# Altium project MB784.PrjPCB
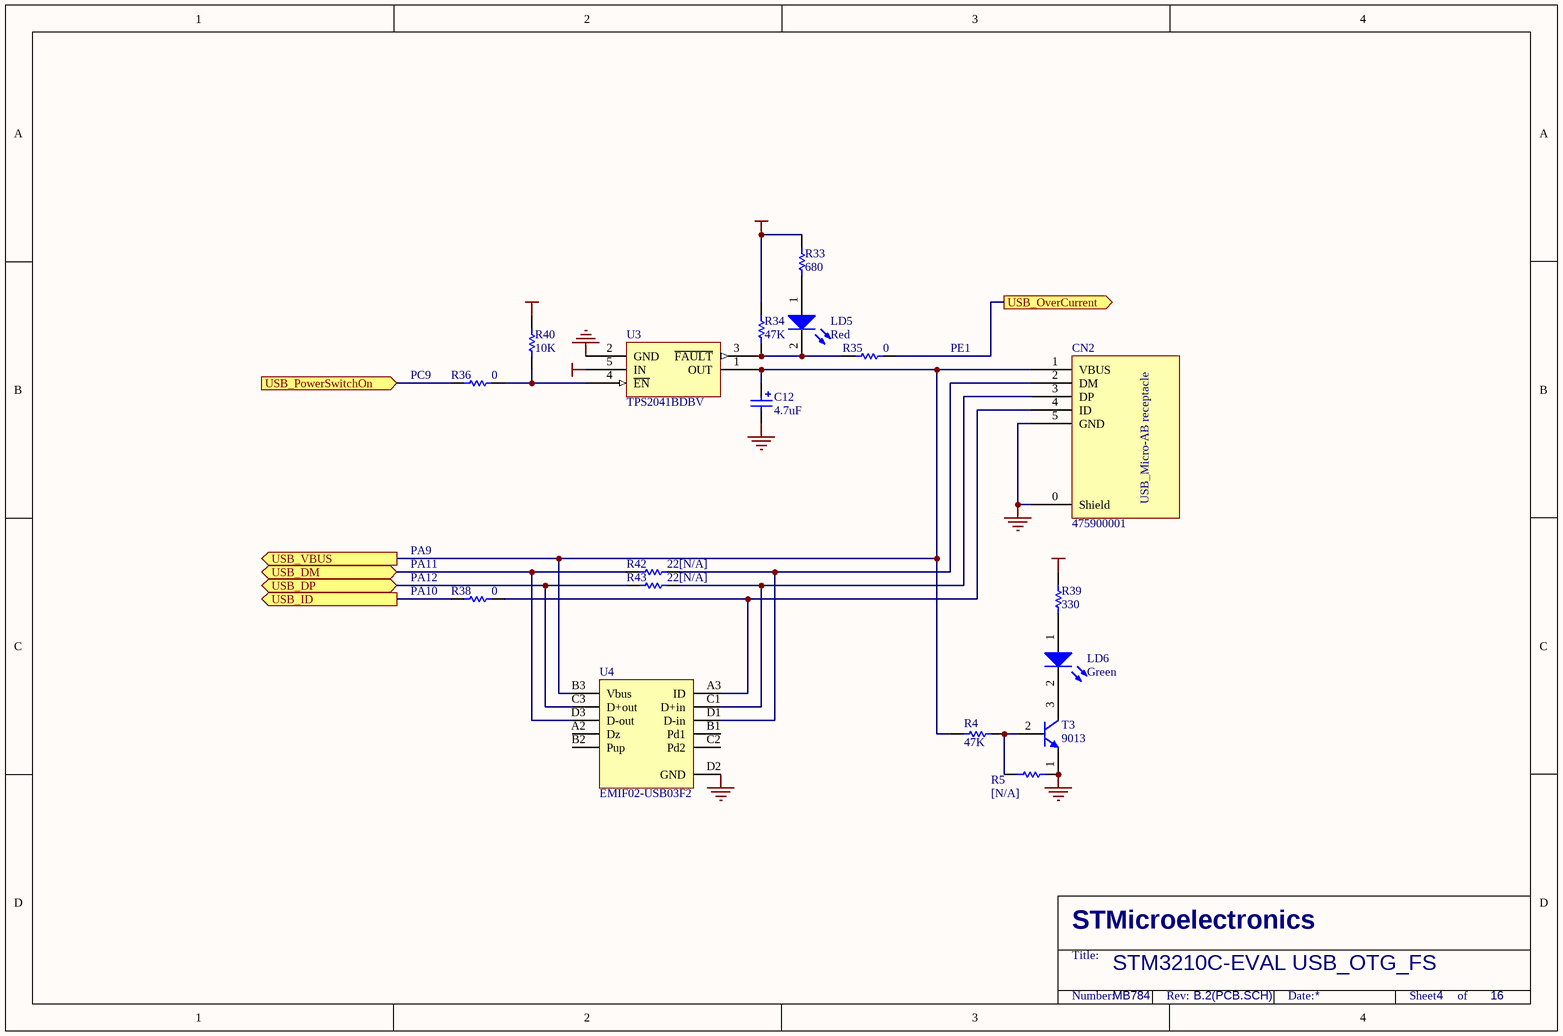
[diagram p0: USB_OTG_FS.SchDoc]
10 sheets, 267 parts. Net scope: flat (ports and power ports of the same name join across sheets).
Board file: MB784.PCBDOC
Sheets:
  USB_OTG_FS.SchDoc
  Ethernet.SchDoc
  IO_Expandor.SchDoc
  MCU.SchDoc
  Audio.SchDoc
  IO Peripherals.SchDoc
  ExtensionConnector.SchDoc
  JTAG&Trace.SchDoc
  Power.SchDoc
  MicroSDCard.SchDoc

## Sheet USB_OTG_FS.SchDoc
size A4; Revision: B.2(PCB.SCH)

### Parts
C12  4.7uF  [TAN-A]
CN2  475900001  [USB-MICRO-AB]
LD5  Red  [0603D]
LD6  Green  [0603D]
R4  47K  [0603R]
R5  [N/A]  [0603R]
R33  680  [0603R]
R34  47K  [0603R]
R35  0  [0603R]
R36  0  [0603R]
R38  0  [0603R]
R39  330  [0603R]
R40  10K  [0603R]
R42  22[N/A]  [0603R]
R43  22[N/A]  [0603R]
T3  9013  [SOT-23]
U3  TPS2041BDBV  [SOT-23-5L]
U4  EMIF02-USB03F2  [FlipChip(11)]

### Ports
USB_DM (bidir), USB_DP (bidir), USB_ID (out), USB_OverCurrent (out), USB_PowerSwitchOn (in), USB_VBUS (out)

### Nets
+3V3: R33.2 R34.1 R39.2 R40.1
+5V: U3.5(IN)
GND: C12.2 CN2.0(Shield) CN2.5(GND) R5.1 T3.1(E) U3.2(GND) U4.D2(GND)
PA10: R38.2 ; port USB_ID
PA11: R42.2 U4.D3(D-out) ; port USB_DM
PA12: R43.2 U4.C3(D+out) ; port USB_DP
PC9: R36.2 ; port USB_PowerSwitchOn
PE1: R35.1 ; port USB_OverCurrent
NetC12_1: C12.1 CN2.1(VBUS) R4.2 U3.1(OUT) U4.B3(Vbus) ; port USB_VBUS
NetCN2_2: CN2.2(DM) R42.1 U4.D1(D-in)
NetCN2_3: CN2.3(DP) R43.1 U4.C1(D+in)
NetCN2_4: CN2.4(ID) R38.1 U4.A3(ID)
NetLD5_1: LD5.1(A) R33.1
NetLD5_2: LD5.2(K) R34.2 R35.2 U3.3(~{FAULT})
NetLD6_1: LD6.1(A) R39.1
NetLD6_2: LD6.2(K) T3.3(C)
NetR4_1: R4.1 R5.2 T3.2(B)
NetR36_1: R36.1 R40.2 U3.4(~{EN})

Not connected (* = marked no-connect by the designer): U4 A2(Dz) B1(Pd1) B2(Pup) C2(Pd2)

### Notes on the sheet
- (near R36) PC9
- PE1
- PA9
- (near R38) PA11
- (near R38) PA12
- (near R38) PA10
- STM3210C-EVAL USB_OTG_FS
- MB784
- 4
- 16
- STMicroelectronics
- Title:
- Number:
- Rev:
- Date:
- Sheet       of
- (in symbol 475900001) USB_Micro-AB receptacle

### Library data of the parts
C12 = Cap Pol1: Polarized Capacitor (Radial); Value: 47uF; Published: 8-Jun-2000; Revision: July-2002: Re-released for DXP Platform.; Publisher: Altium Limited
LD5 LD6 = LED2: Typical RED, GREEN, YELLOW, AMBER GaAs LED; Published: 8-Jun-2000; Revision: July-2002: Re-released for DXP Platform.; Publisher: Altium Limited
R4 R5 R34 R39 R40 = res1: Resistor; Value: 1K; Published: 8-Jun-2000; Revision: July-2002: Re-released for DXP Platform.; Publisher: Altium Limited
R33 R35 R36 R38 R42 R43 = Res1: Resistor; Value: 1K; Published: 8-Jun-2000; Revision: July-2002: Re-released for DXP Platform.; Publisher: Altium Limited
T3 = NPN: NPN Bipolar Transistor; Code - JEDEC: TO-226-AA; Published: 8-Jun-2000; Revision: July-2002: Re-released for DXP Platform.; Publisher: Altium Limited
U3 = STMPS2141STR

## Sheet Ethernet.SchDoc
size A4; Revision: B.2(PCB.SCH)
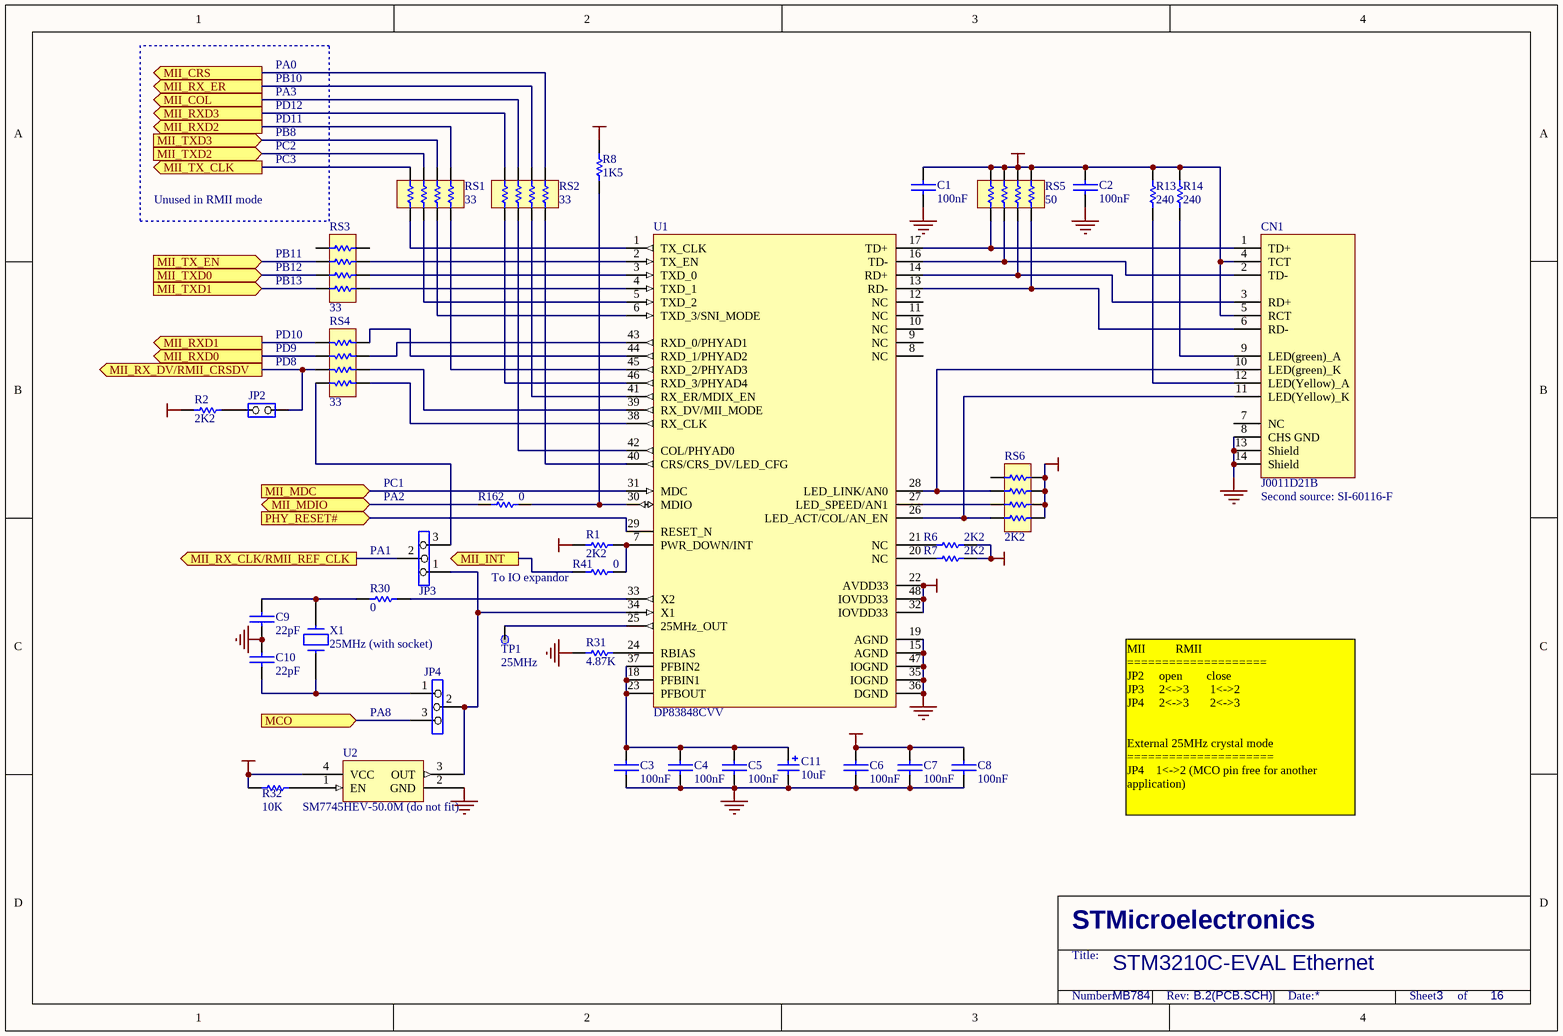
[diagram p1: Ethernet.SchDoc]

### Parts
C1  100nF  [0603C]
C2  100nF  [0603C]
C3  100nF  [0603C]
C4  100nF  [0603C]
C5  100nF  [0603C]
C6  100nF  [0603C]
C7  100nF  [0603C]
C8  100nF  [0603C]
C9  22pF  [0603R]
C10  22pF  [0603R]
C11  10uF  [TAN-A]
CN1  J0011D21B  [J0011D21B]
JP2  (no value)  [SIP2]
JP3  (no value)  [SIP3]
JP4  (no value)  [SIP3]
R1  2K2  [0603R]
R2  2K2  [0603R]
R6  2K2  [0603R]
R7  2K2  [0603R]
R8  1K5  [0603R]
R13  240  [0603R]
R14  240  [0603R]
R30  0  [0603R]
R31  4.87K  [0603R]
R32  10K  [0603R]
R41  0  [0603R]
R162  0  [0603R]
RS1  33  [RES-4B]
RS2  33  [RES-4B]
RS3  33  [RES-4B]
RS4  33  [RES-4B]
RS5  50  [RES-4B]
RS6  2K2  [RES-4B]
TP1  25MHz  [TP]
U1  DP83848CVV  [LQFP48]
U2  SM7745HEV-50.0M (do not fit)  [XTAL_5X7]
X1  25MHz (with socket)  [XTAL1]

### Ports
MCO (in), MII_COL (out), MII_CRS (out), MII_INT (out), MII_MDC (in), MII_MDIO (bidir), MII_RX_CLK/RMII_REF_CLK (out), MII_RX_DV/RMII_CRSDV (out), MII_RX_ER (out), MII_RXD0 (out), MII_RXD1 (out), MII_RXD2 (out), MII_RXD3 (out), MII_TX_CLK (out), MII_TX_EN (in), MII_TXD0 (in), MII_TXD1 (in), MII_TXD2 (in), MII_TXD3 (in), PHY_RESET# (in)

### Nets
+3V3: C1.2 C2.2 C6.1 C7.2 C8.2 CN1.4(TCT) CN1.5(RCT) R1.1 R2.2 R6.2 R7.2 R8.2 R13.2 R14.2 R32.1 RS5.1 RS5.3 RS5.5 RS5.7 RS6.1 RS6.3 RS6.5 RS6.7 U1.22(AVDD33) U1.32(IOVDD33) U1.48(IOVDD33) U2.4(VCC)
GND: C1.1 C2.1 C3.2 C4.1 C5.1 C6.2 C7.1 C8.1 C9.1 C10.2 C11.2 CN1.8(CHS_GND) CN1.13(Shield) CN1.14(Shield) R31.1 U1.15(AGND) U1.19(AGND) U1.35(IOGND) U1.36(DGND) U1.47(IOGND) U2.2(GND)
PA1: JP3.2 ; port MII_RX_CLK/RMII_REF_CLK
PA2: R162.1 ; port MII_MDIO
PA3: RS2.4 ; port MII_COL
PA8: JP4.3 ; port MCO
PB8: RS1.6 ; port MII_TXD3
PB10: RS2.6 ; port MII_RX_ER
PB11: RS3.6 ; port MII_TX_EN
PB12: RS3.4 ; port MII_TXD0
PB13: RS3.2 ; port MII_TXD1
PC1: U1.31(MDC) ; port MII_MDC
PC2: RS1.4 ; port MII_TXD2
PC3: RS1.2 ; port MII_TX_CLK
PD11: RS1.8 ; port MII_RXD2
PD12: RS2.2 ; port MII_RXD3
NetC3_1: C3.1 C4.2 C5.2 C11.1 U1.18(PFBIN1) U1.23(PFBOUT) U1.37(PFBIN2)
NetC9_2: C9.2 R30.2 X1.2
NetC10_1: C10.1 JP4.1 X1.1
NetCN1_1: CN1.1(TD+) RS5.8 U1.17(TD+)
NetCN1_2: CN1.2(TD-) RS5.6 U1.16(TD-)
NetCN1_3: CN1.3(RD+) RS5.4 U1.14(RD+)
NetCN1_6: CN1.6(RD-) RS5.2 U1.13(RD-)
NetCN1_9: CN1.9(LED(green)_A) R14.1
NetCN1_10: CN1.10(LED(green)_K) RS6.6 U1.28(LED_LINK/AN0)
NetCN1_11: CN1.11(LED(Yellow)_K) RS6.2 U1.26(LED_ACT/COL/AN_EN)
NetCN1_12: CN1.12(LED(Yellow)_A) R13.1
NetJP2_1: JP2.1(COMMON) RS4.6 ; port MII_RX_DV/RMII_CRSDV
NetJP2_2: JP2.2(NO) R2.1
NetJP3_1: JP3.1 JP4.2 U1.34(X1) U2.3(OUT)
NetJP3_3: JP3.3 RS4.8
NetJP11_3: RS4.2 ; port MII_RXD1
NetJP12_3: RS4.4 ; port MII_RXD0
NetJP14_1: RS2.8 ; port MII_CRS
NetR1_2: R1.2 R41.2 U1.7(PWR_DOWN/INT)
NetR6_1: R6.1 U1.21(NC)
NetR7_1: R7.1 U1.20(NC)
NetR8_1: R8.1 R162.2 U1.30(MDIO)
NetR30_1: R30.1 U1.33(X2)
NetR31_2: R31.2 U1.24(RBIAS)
NetR32_2: R32.2 U2.1(EN)
NetR41_1: R41.1 ; port MII_INT
NetRS1_1: RS1.1 U1.1(TX_CLK)
NetRS1_3: RS1.3 U1.5(TXD_2)
NetRS1_5: RS1.5 U1.6(TXD_3/SNI_MODE)
NetRS1_7: RS1.7 U1.45(RXD_2/PHYAD3)
NetRS2_1: RS2.1 U1.46(RXD_3/PHYAD4)
NetRS2_3: RS2.3 U1.42(COL/PHYAD0)
NetRS2_5: RS2.5 U1.41(RX_ER/MDIX_EN)
NetRS2_7: RS2.7 U1.40(CRS/CRS_DV/LED_CFG)
NetRS3_1: RS3.1 U1.4(TXD_1)
NetRS3_3: RS3.3 U1.3(TXD_0)
NetRS3_5: RS3.5 U1.2(TX_EN)
NetRS4_1: RS4.1 U1.44(RXD_1/PHYAD2)
NetRS4_3: RS4.3 U1.43(RXD_0/PHYAD1)
NetRS4_5: RS4.5 U1.39(RX_DV/MII_MODE)
NetRS4_7: RS4.7 U1.38(RX_CLK)
NetRS6_4: RS6.4 U1.27(LED_SPEED/AN1)
NetTP1_1: TP1.1 U1.25(25MHz_OUT)
NetU1_29: U1.29(RESET_N) ; port PHY_RESET#

Not connected (* = marked no-connect by the designer): CN1 7(NC); RS3 7 8; RS6 8; U1 8(NC) 9(NC) 10(NC) 11(NC) 12(NC)

### Notes on the sheet
- PD12
- PB10
- PA3
- PA0
- PC3
- PC2
- PB8
- PD11
- Unused in RMII mode
- (near RS3) PB11
- (near RS3) PB12
- (near RS3) PB13
- PD9
- (near RS4) PD10
- PD8
- PC1
- (near JP3) PA2
- (near CN1) Second source: SI-60116-F
- PA1
- (near R41) To IO expandor
- PA8
- MII          RMII
  ====================
  JP2     open        close
  JP3     2<->3       1<->2
  JP4     2<->3       2<->3
  External 25MHz crystal mode
  =====================
  JP4    1<->2 (MCO pin free for another application)
- STM3210C-EVAL Ethernet
- MB784
- 3
- 16
- STMicroelectronics
- Title:
- Number:
- Rev:
- Date:
- Sheet       of

### Library data of the parts
C1-C10 = CAP: Capacitor
C11 = Cap Pol1: Polarized Capacitor (Radial); Published: 8-Jun-2000; Revision: July-2002: Re-released for DXP Platform.; Publisher: Altium Limited; Value: 10uF
JP2 = JP2
JP3 JP4 = Jumper3
R1 R2 R6-R8 R13 R14 R30-R32 R41 R162 = Res1: Resistor; Value: 1K; Published: 8-Jun-2000; Revision: July-2002: Re-released for DXP Platform.; Publisher: Altium Limited
RS1-RS6 = Resister Array
TP1 = TP
U2 = SM7745HEV-50.0M
X1 = CRYSTAL

## Sheet IO_Expandor.SchDoc
size A4; Revision: B.2(PCB.SCH)
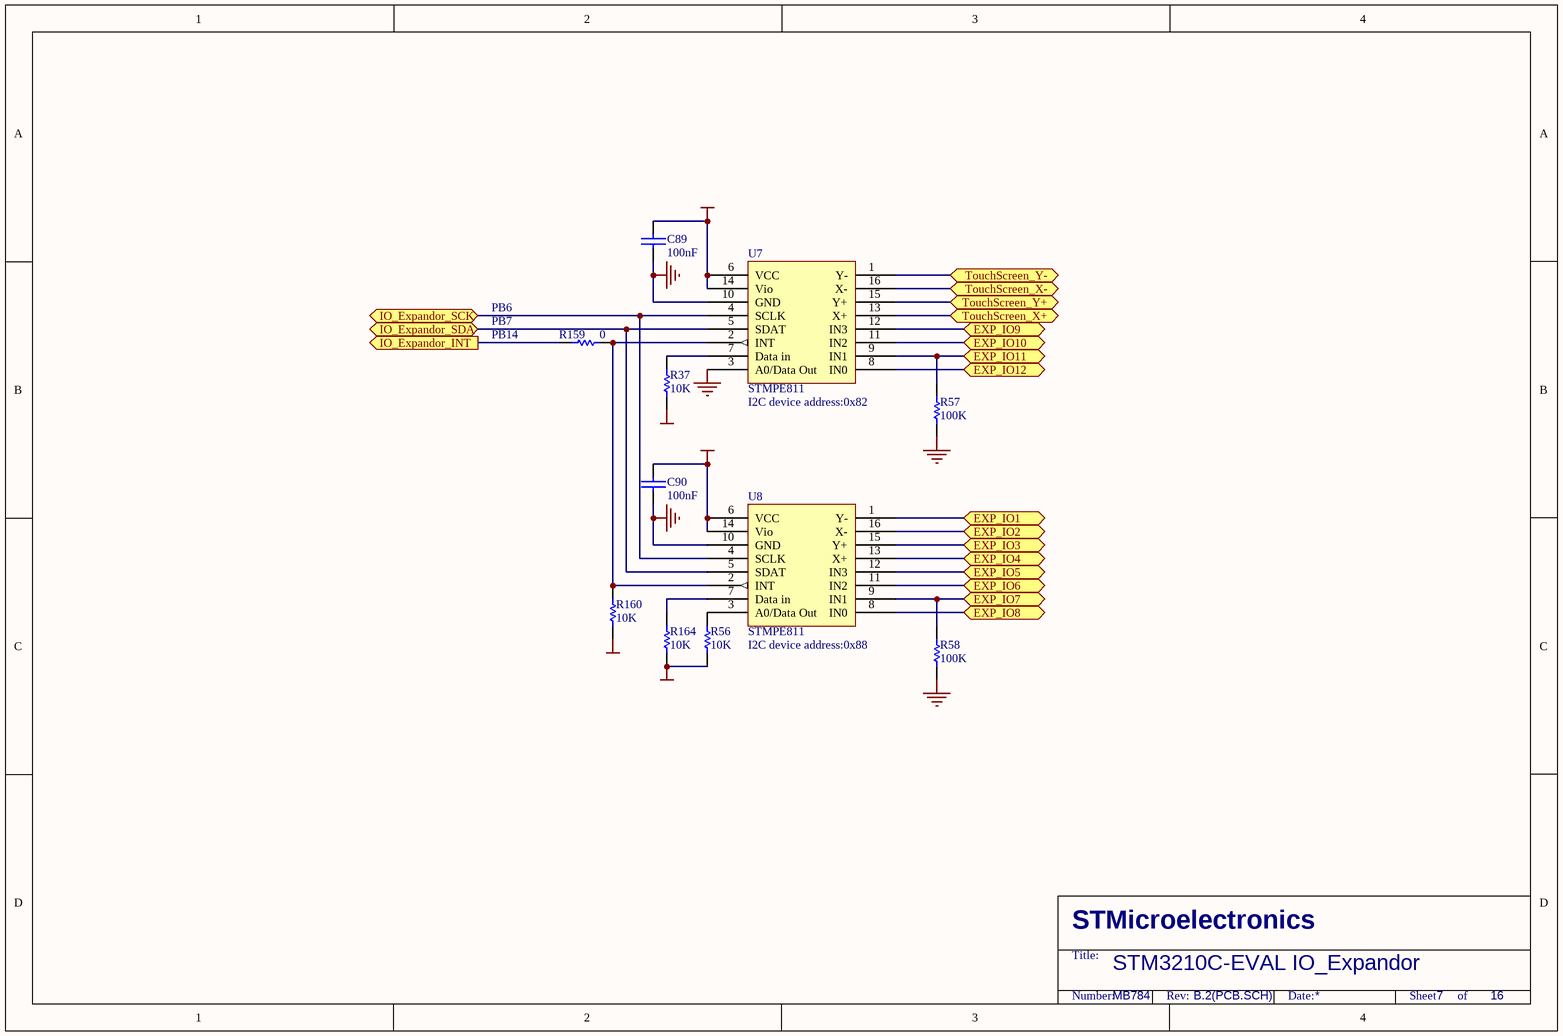
[diagram p2: IO_Expandor.SchDoc]

### Parts
C89  100nF  [0603C]
C90  100nF  [0603C]
R37  10K  [0603R]
R56  10K  [0603R]
R57  100K  [0603R]
R58  100K  [0603R]
R159  0  [0603R]
R160  10K  [0603R]
R164  10K  [0603R]
U7  STMPE811  [QFN16(3X3)]
U8  STMPE811  [QFN16(3X3)]

### Ports
EXP_IO1 (bidir), EXP_IO2 (bidir), EXP_IO3 (bidir), EXP_IO4 (bidir), EXP_IO5 (bidir), EXP_IO6 (bidir), EXP_IO7 (bidir), EXP_IO8 (bidir), EXP_IO9 (bidir), EXP_IO10 (bidir), EXP_IO11 (bidir), EXP_IO12 (bidir), IO_Expandor_INT (out), IO_Expandor_SCK (bidir), IO_Expandor_SDA (bidir), TouchScreen_X+ (bidir), TouchScreen_X- (bidir), TouchScreen_Y+ (bidir), TouchScreen_Y- (bidir)

### Nets
+3V3: C89.1 C90.2 R37.2 R56.2 R160.2 R164.2 U7.6(VCC) U7.14(Vio) U8.6(VCC) U8.14(Vio)
GND: C89.2 C90.1 R57.2 R58.2 U7.3(A0/Data_Out) U7.10(GND) U8.10(GND)
PB14: R159.1 ; port IO_Expandor_INT
NetR37_1: R37.1 U7.7(Data_in)
NetR56_1: R56.1 U8.3(A0/Data_Out)
NetR57_1: R57.1 U7.9(IN1) ; port EXP_IO11
NetR58_1: R58.1 U8.9(IN1) ; port EXP_IO7
NetR159_2: R159.2 R160.1 U7.2(INT) U8.2(INT)
NetR164_1: R164.1 U8.7(Data_in)
NetU7_1: U7.1(Y-) ; port TouchScreen_Y-
NetU7_4: U7.4(SCLK) U8.4(SCLK) ; port IO_Expandor_SCK
NetU7_5: U7.5(SDAT) U8.5(SDAT) ; port IO_Expandor_SDA
NetU7_8: U7.8(IN0) ; port EXP_IO12
NetU7_11: U7.11(IN2) ; port EXP_IO10
NetU7_12: U7.12(IN3) ; port EXP_IO9
NetU7_13: U7.13(X+) ; port TouchScreen_X+
NetU7_15: U7.15(Y+) ; port TouchScreen_Y+
NetU7_16: U7.16(X-) ; port TouchScreen_X-
NetU8_1: U8.1(Y-) ; port EXP_IO1
NetU8_8: U8.8(IN0) ; port EXP_IO8
NetU8_11: U8.11(IN2) ; port EXP_IO6
NetU8_12: U8.12(IN3) ; port EXP_IO5
NetU8_13: U8.13(X+) ; port EXP_IO4
NetU8_15: U8.15(Y+) ; port EXP_IO3
NetU8_16: U8.16(X-) ; port EXP_IO2

### Notes on the sheet
- PB6
- PB7
- PB14
- (near U7) I2C device address:0x82
- I2C device address:0x88
- STM3210C-EVAL IO_Expandor
- MB784
- 7
- 16
- STMicroelectronics
- Title:
- Number:
- Rev:
- Date:
- Sheet       of

### Library data of the parts
C89 C90 = CAP: Capacitor
R37 R56-R58 R159 R160 R164 = Res1: Resistor; Value: 1K; Published: 8-Jun-2000; Revision: July-2002: Re-released for DXP Platform.; Publisher: Altium Limited

## Sheet MCU.SchDoc
size A4; Revision: B.2(PCB.SCH)
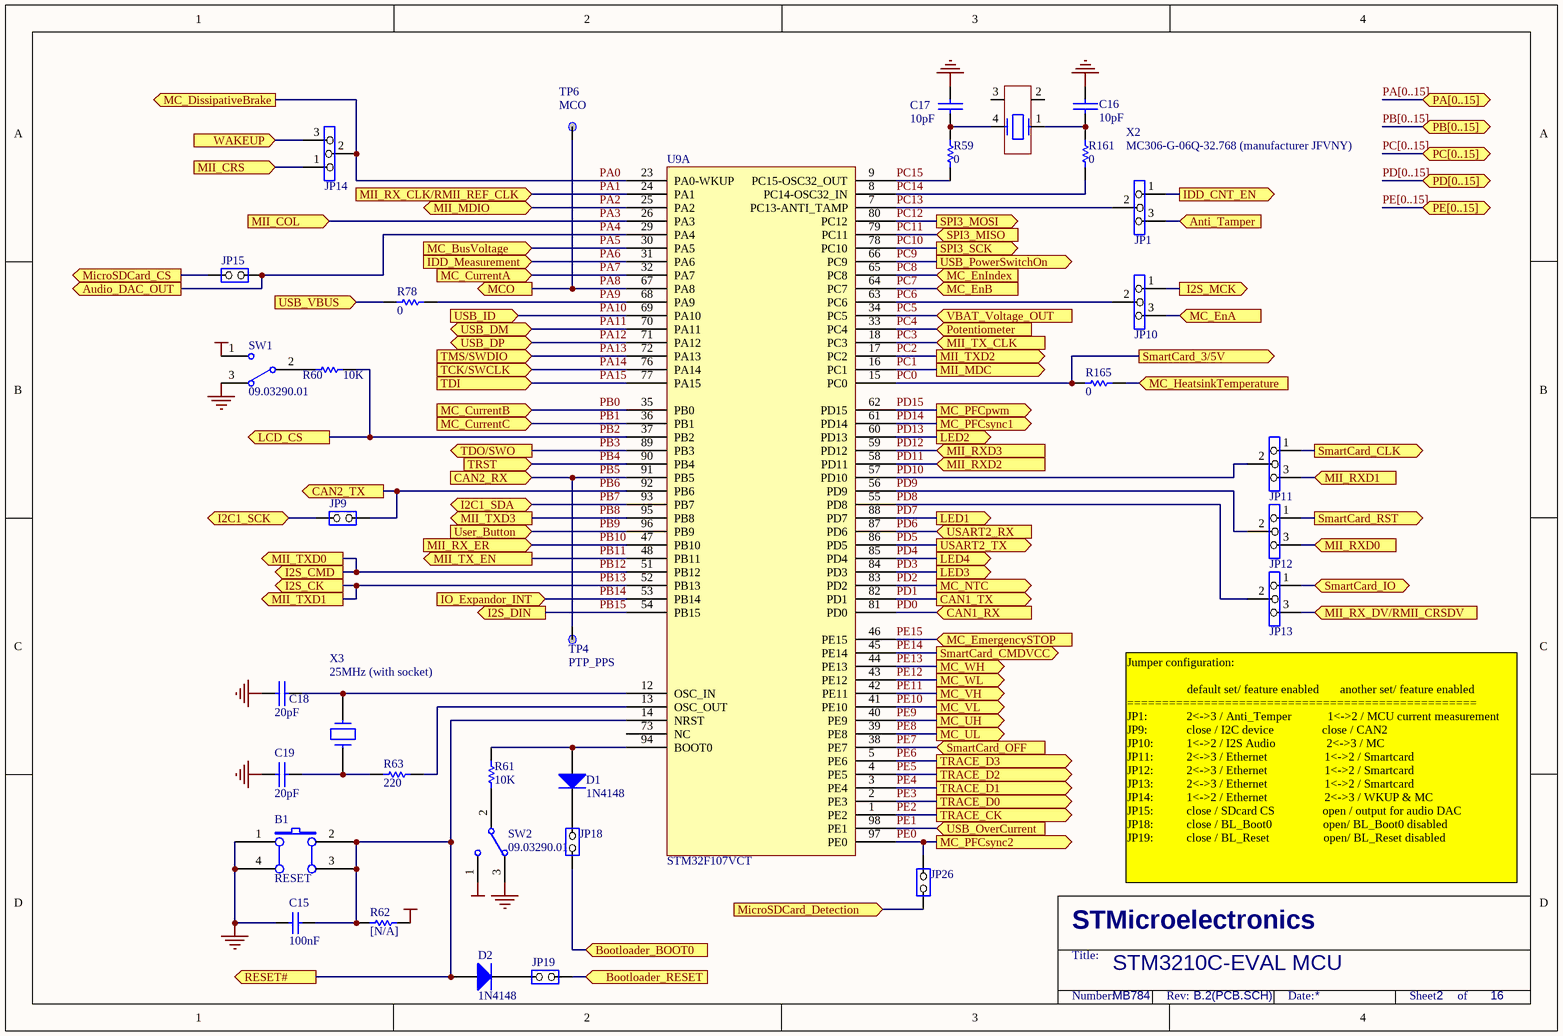
[diagram p3: MCU.SchDoc]

### Parts
B1  RESET  [PB10]
C15  100nF  [0603C]
C16  10pF  [0603C]
C17  10pF  [0603C]
C18  20pF  [0603C]
C19  20pF  [0603C]
D1  1N4148  [1504D]
D2  1N4148  [1504D]
JP1  (no value)  [SIP3]
JP9  (no value)  [SIP2]
JP10  (no value)  [SIP3]
JP11  (no value)  [SIP3]
JP12  (no value)  [SIP3]
JP13  (no value)  [SIP3]
JP14  (no value)  [SIP3]
JP15  (no value)  [SIP2]
JP18  (no value)  [SIP2]
JP19  (no value)  [SIP2]
JP26  (no value)  [SIP2]
R59  0  [0603R]
R60  10K  [0603R]
R61  10K  [0603R]
R62  [N/A]  [0603R]
R63  220  [0603R]
R78  0  [0603R]
R161  0  [0603R]
R165  0  [0603R]
SW1  09.03290.01  [SIP3]
SW2  09.03290.01  [SIP3]
TP4  PTP_PPS  [TP]
TP6  MCO  [TP]
U9  STM32F107VCT  [TQ100_TOOL]  (part A of 2)
X2  MC306-G-06Q-32.768 (manufacturer JFVNY)  [SM8]
X3  25MHz (with socket)  [XTAL_socket]

### Ports
Anti_Tamper (in), Audio_DAC_OUT (out), Bootloader_BOOT0 (in), Bootloader_RESET (in), CAN1_RX (in), CAN1_TX (out), CAN2_RX (in), CAN2_TX (out), I2C1_SCK (bidir), I2C1_SDA (bidir), I2S_CK (out), I2S_CMD (out), I2S_DIN (out), I2S_MCK (out), IDD_CNT_EN (out), IDD_Measurement (in), IO_Expandor_INT (in), LCD_CS (out), LED1 (out), LED2 (out), LED3 (out), LED4 (out), MC_BusVoltage (in), MC_CurrentA (in), MC_CurrentB (in), MC_CurrentC (in), MC_DissipativeBrake (out), MC_EmergencySTOP (in), MC_EnA (in), MC_EnB (in), MC_EnIndex (in), MC_HeatsinkTemperature (in), MC_NTC (out), MC_PFCpwm (out), MC_PFCsync1 (out), MC_PFCsync2 (out), MC_UH (out), MC_UL (out), MC_VH (out), MC_VL (out), MC_WH (out), MC_WL (out), MCO (out), MicroSDCard_CS (out), MicroSDCard_Detection (in), MII_COL (in), MII_CRS (in), MII_MDC (out), MII_MDIO (bidir), MII_RX_CLK/RMII_REF_CLK (in), MII_RX_DV/RMII_CRSDV (in), MII_RX_ER (in), MII_RXD0 (in), MII_RXD1 (in), MII_RXD2 (in), MII_RXD3 (in), MII_TX_CLK (in), MII_TX_EN (out), MII_TXD0 (out), MII_TXD1 (out), MII_TXD2 (out), MII_TXD3 (out), PA[0..15] (bidir), PB[0..15] (bidir), PC[0..15] (bidir), PD[0..15] (bidir), PE[0..15] (bidir), Potentiometer (in), RESET# (out), SmartCard_3/5V (out), SmartCard_CLK (out), SmartCard_CMDVCC (out), SmartCard_IO (bidir), SmartCard_OFF (in), SmartCard_RST (out), SPI3_MISO (in), SPI3_MOSI (out), SPI3_SCK (out), TCK/SWCLK (in), TDI (in), TDO/SWO (out), TMS/SWDIO (in), TRACE_CK (out), TRACE_D0 (out), TRACE_D1 (out), TRACE_D2 (out), TRACE_D3 (out), TRST (in), USART2_RX (in), USART2_TX (out), USB_DM (bidir), USB_DP (bidir), USB_ID (in), USB_OverCurrent (in), USB_PowerSwitchOn (out), USB_VBUS (in), User_Button (in), VBAT_Voltage_OUT (in), WAKEUP (in)

### Nets
+3V3: R62.2 SW1.1 SW2.1
GND: B1.1(A0) B1.4(A1) C15.1 C16.2 C17.2 C18.2 C19.2 SW1.3 SW2.3
PA0: JP14.2 U9.23(PA0-WKUP) ; port MC_DissipativeBrake
PA1: U9.24(PA1) ; port MII_RX_CLK/RMII_REF_CLK
PA2: U9.25(PA2) ; port MII_MDIO
PA3: U9.26(PA3) ; port MII_COL
PA4: JP15.1(COMMON) U9.29(PA4) ; port Audio_DAC_OUT
PA5: U9.30(PA5) ; port MC_BusVoltage
PA6: U9.31(PA6) ; port IDD_Measurement
PA7: U9.32(PA7) ; port MC_CurrentA
PA8: TP6.1 U9.67(PA8) ; port MCO
PA9: R78.2 U9.68(PA9)
PA10: U9.69(PA10) ; port USB_ID
PA11: U9.70(PA11) ; port USB_DM
PA12: U9.71(PA12) ; port USB_DP
PA13: U9.72(PA13) ; port TMS/SWDIO
PA14: U9.76(PA14) ; port TCK/SWCLK
PA15: U9.77(PA15) ; port TDI
PB0: U9.35(PB0) ; port MC_CurrentB
PB1: U9.36(PB1) ; port MC_CurrentC
PB2: R60.1 U9.37(PB2) ; port LCD_CS
PB3: U9.89(PB3) ; port TDO/SWO
PB4: U9.90(PB4) ; port TRST
PB5: TP4.1 U9.91(PB5) ; port CAN2_RX
PB6: JP9.1(COMMON) U9.92(PB6) ; port CAN2_TX
PB7: U9.93(PB7) ; port I2C1_SDA
PB8: U9.95(PB8) ; port MII_TXD3
PB9: U9.96(PB9) ; port User_Button
PB10: U9.47(PB10) ; port MII_RX_ER
PB11: U9.48(PB11) ; port MII_TX_EN
PB12: U9.51(PB12) ; port I2S_CMD, port MII_TXD0
PB13: U9.52(PB13) ; port I2S_CK, port MII_TXD1
PB14: U9.53(PB14) ; port IO_Expandor_INT
PB15: U9.54(PB15) ; port I2S_DIN
PC0: R165.1 U9.15(PC0) ; port SmartCard_3/5V
PC1: U9.16(PC1) ; port MII_MDC
PC2: U9.17(PC2) ; port MII_TXD2
PC3: U9.18(PC3) ; port MII_TX_CLK
PC4: U9.33(PC4) ; port Potentiometer
PC5: U9.34(PC5) ; port VBAT_Voltage_OUT
PC6: JP10.2 U9.63(PC6)
PC7: U9.64(PC7) ; port MC_EnB
PC8: U9.65(PC8) ; port MC_EnIndex
PC9: U9.66(PC9) ; port USB_PowerSwitchOn
PC10: U9.78(PC10) ; port SPI3_SCK
PC11: U9.79(PC11) ; port SPI3_MISO
PC12: U9.80(PC12) ; port SPI3_MOSI
PC13: JP1.2 U9.7(PC13-ANTI_TAMP)
PC14: R161.2 U9.8(PC14-OSC32_IN)
PC15: R59.2 U9.9(PC15-OSC32_OUT)
PD0: U9.81(PD0) ; port CAN1_RX
PD1: U9.82(PD1) ; port CAN1_TX
PD2: U9.83(PD2) ; port MC_NTC
PD3: U9.84(PD3) ; port LED3
PD4: U9.85(PD4) ; port LED4
PD5: U9.86(PD5) ; port USART2_TX
PD6: U9.87(PD6) ; port USART2_RX
PD7: U9.88(PD7) ; port LED1
PD8: JP13.2 U9.55(PD8)
PD9: JP12.2 U9.56(PD9)
PD10: JP11.2 U9.57(PD10)
PD11: U9.58(PD11) ; port MII_RXD2
PD12: U9.59(PD12) ; port MII_RXD3
PD13: U9.60(PD13) ; port LED2
PD14: U9.61(PD14) ; port MC_PFCsync1
PD15: U9.62(PD15) ; port MC_PFCpwm
PE0: JP26.2(NO) U9.97(PE0) ; port MC_PFCsync2
PE1: U9.98(PE1) ; port USB_OverCurrent
PE2: U9.1(PE2) ; port TRACE_CK
PE3: U9.2(PE3) ; port TRACE_D0
PE4: U9.3(PE4) ; port TRACE_D1
PE5: U9.4(PE5) ; port TRACE_D2
PE6: U9.5(PE6) ; port TRACE_D3
PE7: U9.38(PE7) ; port SmartCard_OFF
PE8: U9.39(PE8) ; port MC_UL
PE9: U9.40(PE9) ; port MC_UH
PE10: U9.41(PE10) ; port MC_VL
PE11: U9.42(PE11) ; port MC_VH
PE12: U9.43(PE12) ; port MC_WL
PE13: U9.44(PE13) ; port MC_WH
PE14: U9.45(PE14) ; port SmartCard_CMDVCC
PE15: U9.46(PE15) ; port MC_EmergencySTOP
RESET#: B1.2(B0) B1.3(B1) C15.2 D2.1(A) R62.1 U9.14(NRST) ; port RESET#
NetC12_1: R78.1 ; port USB_VBUS
NetC16_1: C16.1 R161.1 X2.1
NetC17_1: C17.1 R59.1 X2.4
NetC18_1: C18.1 U9.12(OSC_IN) X3.2
NetC19_1: C19.1 R63.2 X3.1
NetD1_1: D1.1(A) R61.1 U9.94(BOOT0)
NetD1_2: D1.2(K) JP18.1(COMMON)
NetD2_2: D2.2(K) JP19.1(COMMON)
NetJP1_1: JP1.1 ; port IDD_CNT_EN
NetJP1_3: JP1.3 ; port Anti_Tamper
NetJP2_1: JP13.3 ; port MII_RX_DV/RMII_CRSDV
NetJP9_2: JP9.2(NO) ; port I2C1_SCK
NetJP10_1: JP10.1 ; port I2S_MCK
NetJP10_3: JP10.3 ; port MC_EnA
NetJP11_1: JP11.1 ; port SmartCard_CLK
NetJP11_3: JP11.3 ; port MII_RXD1
NetJP12_1: JP12.1 ; port SmartCard_RST
NetJP12_3: JP12.3 ; port MII_RXD0
NetJP13_1: JP13.1 ; port SmartCard_IO
NetJP14_1: JP14.1 ; port MII_CRS
NetJP14_3: JP14.3 ; port WAKEUP
NetJP15_2: JP15.2(NO) ; port MicroSDCard_CS
NetJP18_2: JP18.2(NO) ; port Bootloader_BOOT0
NetJP19_2: JP19.2(NO) ; port Bootloader_RESET
NetJP26_1: JP26.1(COMMON) ; port MicroSDCard_Detection
NetR60_2: R60.2 SW1.2
NetR61_2: R61.2 SW2.2
NetR63_1: R63.1 U9.13(OSC_OUT)
NetR165_2: R165.2 ; port MC_HeatsinkTemperature

Not connected (* = marked no-connect by the designer): U9 73(NC); X2 2 3

### Buses and harness runs
bus PA[0..15] = port PA[0..15]
bus PB[0..15] = port PB[0..15]
bus PC[0..15] = port PC[0..15]
bus PD[0..15] = port PD[0..15]
bus PE[0..15] = port PE[0..15]

### Notes on the sheet
- (near JP13) Jumper configuration:
  default set/ feature enabled       another set/ feature enabled
  ==================================================
  JP1:             2<->3 / Anti_Temper            1<->2 / MCU current measurement
  JP9:             close / I2C device                close / CAN2
  JP10:           1<->2 / I2S Audio                 2<->3 / MC
  JP11:           2<->3 / Ethernet                   1<->2 / Smartcard
  JP12:           2<->3 / Ethernet                   1<->2 / Smartcard
  JP13:           2<->3 / Ethernet                   1<->2 / Smartcard
  JP14:           1<->2 / Ethernet                   2<->3 / WKUP & MC
  JP15:           close / SDcard CS                open / output for audio DAC
  JP18:           close / BL_Boot0                 open/ BL_Boot0 disabled
  JP19:           close / BL_Reset                  open/ BL_Reset disabled
- STM3210C-EVAL MCU
- MB784
- 2
- 16
- STMicroelectronics
- Title:
- Number:
- Rev:
- Date:
- Sheet       of

### Library data of the parts
B1 = SW PUSHBUTTON: SE PUSHBUTTON
C15 = CAP: Capacitor; Value: 100pF; Published: 8-Jun-2000; Revision: July-2002: Re-released for DXP Platform.; Publisher: Altium Limited
C16-C19 = CAP: Capacitor
D1 D2 = Diode: Default Diode; Code - JEDEC: DO-214-AB; Published: 8-Jun-2000; Revision: July-2002: Re-released for DXP Platform.; Publisher: Altium Limited
JP1 JP10-JP14 = Jumper3
JP9 JP15 JP18 JP19 JP26 = JP2
R59 R63 R78 R161 R165 = Res1: Resistor; Value: 1K; Published: 8-Jun-2000; Revision: July-2002: Re-released for DXP Platform.; Publisher: Altium Limited
R60-R62 = res1: Resistor; Value: 1K; Published: 8-Jun-2000; Revision: July-2002: Re-released for DXP Platform.; Publisher: Altium Limited
SW1 SW2 = SW-SPDT: SPDT Subminiature Toggle Switch, Right Angle Mounting, Vertical Actuation; Revision 1: Jul-2002: Re-released for DXP Platform.; Revision 2: 17-Dec-2003: Schematic revised, PCB Footprint replaced.; Published: 24-Mar-1999; Datasheet: Latest Revision: 05-Dec-2000; Publisher: Altium Limited
TP4 TP6 = TP
U9 = BARRACUDA_256K
X2 = MC306
X3 = CRYSTAL

## Sheet Audio.SchDoc
size A4; Revision: B.2(PCB.SCH)
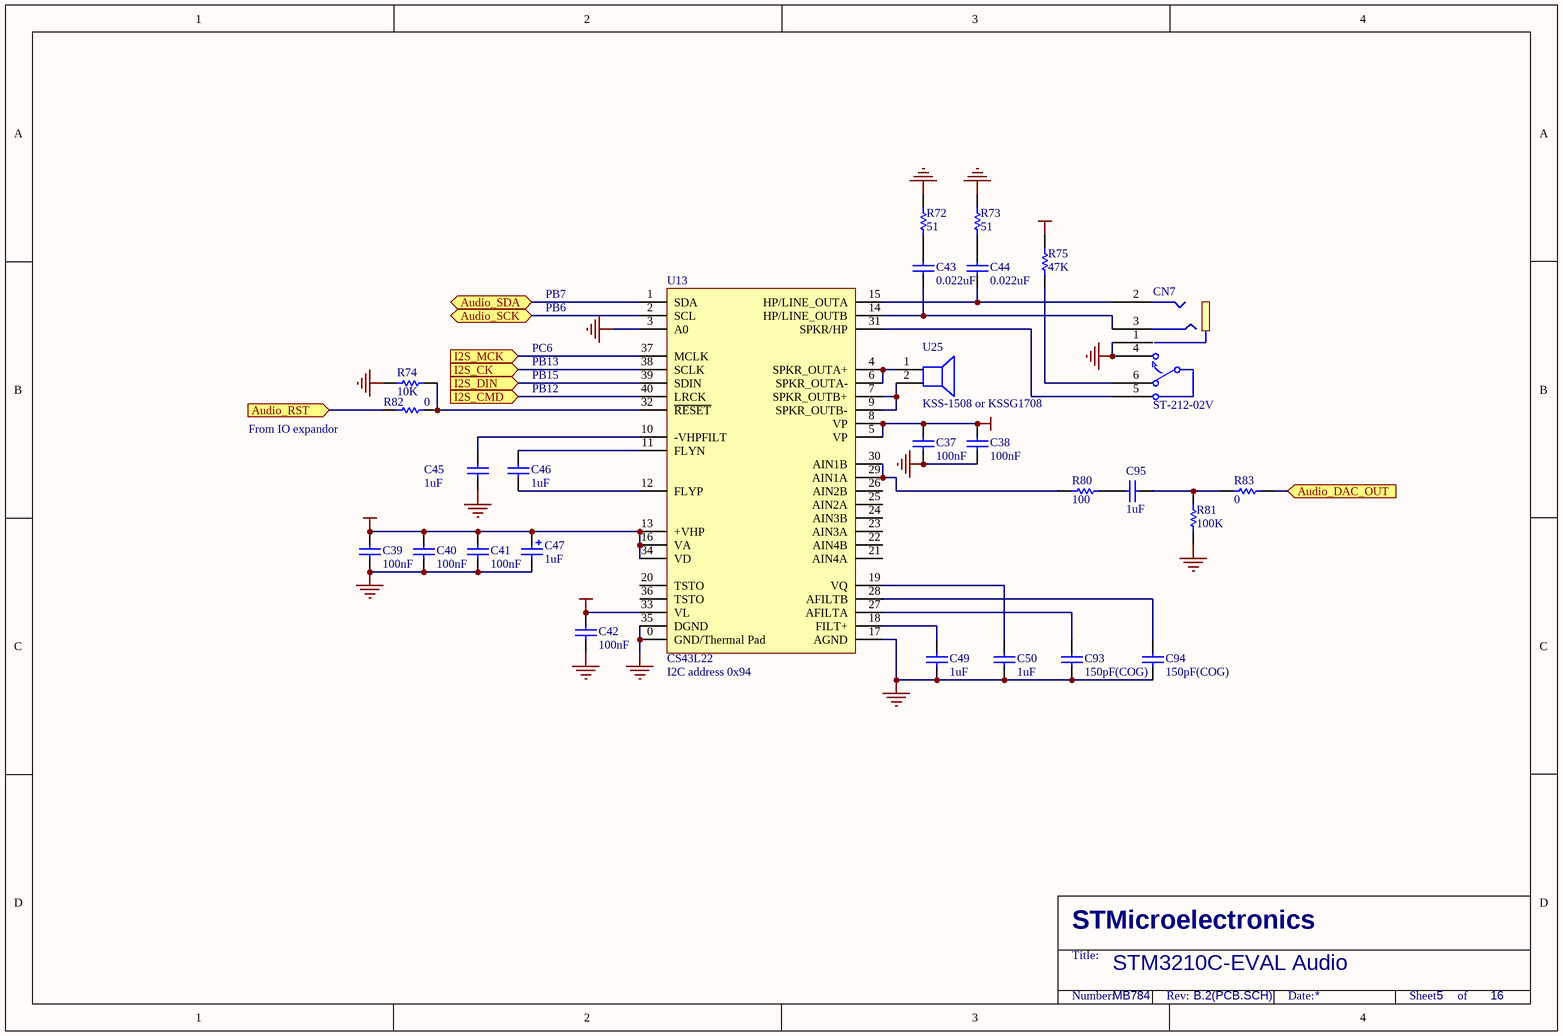
[diagram p4: Audio.SchDoc]

### Parts
C37  100nF  [0603C]
C38  100nF  [0603C]
C39  100nF  [0603C]
C40  100nF  [0603C]
C41  100nF  [0603C]
C42  100nF  [0603C]
C43  0.022uF  [0603C]
C44  0.022uF  [0603C]
C45  1uF  [0603C]
C46  1uF  [0603C]
C47  1uF  [TAN-A]
C49  1uF  [0603C]
C50  1uF  [0603C]
C93  150pF(COG)  [0603C]
C94  150pF(COG)  [0603C]
C95  1uF  [0603C]
CN7  ST-212-02V  [ST-212-02V]
R72  51  [0603R]
R73  51  [0603R]
R74  10K  [0603R]
R75  47K  [0603R]
R80  100  [0603R]
R81  100K  [0603R]
R82  0  [0603R]
R83  0  [0603R]
U13  CS43L22  [QFN40(6*6)]
U25  KSS-1508 or KSSG1708  [KS1708]

### Ports
Audio_DAC_OUT (in), Audio_RST (in), Audio_SCK (bidir), Audio_SDA (bidir), I2S_CK (in), I2S_CMD (in), I2S_DIN (in), I2S_MCK (in)

### Nets
+2V5: C39.2 C40.2 C41.2 C47.1 R75.1 U13.13(+VHP) U13.16(VA) U13.34(VD)
+3V3: C42.2 U13.33(VL)
+5V: C37.1 C38.1 U13.5(VP) U13.8(VP)
GND: C37.2 C38.2 C39.1 C40.1 C41.1 C42.1 C45.2 C47.2 C49.1 C50.1 C93.1 C94.1 CN7.1 CN7.4 R72.1 R73.1 R74.2 R81.2 U13.0(GND/Thermal_Pad) U13.3(A0) U13.17(AGND) U13.35(DGND)
PA4: R83.2 ; port Audio_DAC_OUT
PB12: U13.40(LRCK) ; port I2S_CMD
PB13: U13.38(SCLK) ; port I2S_CK
PB15: U13.39(SDIN) ; port I2S_DIN
NetC43_1: C43.1 R72.2
NetC43_2: C43.2 CN7.3 U13.14(HP/LINE_OUTB)
NetC44_1: C44.1 R73.2
NetC44_2: C44.2 CN7.2 U13.15(HP/LINE_OUTA)
NetC45_1: C45.1 U13.10(-VHPFILT)
NetC46_1: C46.1 U13.12(FLYP)
NetC46_2: C46.2 U13.11(FLYN)
NetC49_2: C49.2 U13.18(FILT+)
NetC50_2: C50.2 U13.19(VQ)
NetC93_2: C93.2 U13.27(AFILTA)
NetC94_2: C94.2 U13.28(AFILTB)
NetC95_1: C95.1 R80.1
NetC95_2: C95.2 R81.1 R83.1
NetCN7_5: CN7.5 U13.31(SPKR/HP)
NetCN7_6: CN7.6 R75.2
NetJP10_1: U13.37(MCLK) ; port I2S_MCK
NetR74_1: R74.1 R82.1 U13.32(~{RESET})
NetR80_2: R80.2 U13.29(AIN1A) U13.30(AIN1B)
NetR82_2: R82.2 ; port Audio_RST
NetU13_1: U13.1(SDA) ; port Audio_SDA
NetU13_2: U13.2(SCL) ; port Audio_SCK
NetU13_4: U13.4(SPKR_OUTA+) U13.6(SPKR_OUTA-) U25.1(+)
NetU13_7: U13.7(SPKR_OUTB+) U13.9(SPKR_OUTB-) U25.2(-)

Not connected (* = marked no-connect by the designer): U13 20(TSTO) 21(AIN4A) 22(AIN4B) 23(AIN3A) 24(AIN3B) 25(AIN2A) 26(AIN2B) 36(TSTO)

### Notes on the sheet
- PB6
- PB7
- PC6
- PB15
- PB13
- From IO expandor
- PB12
- (near U13) I2C address 0x94
- STM3210C-EVAL Audio
- MB784
- 5
- 16
- STMicroelectronics
- Title:
- Number:
- Rev:
- Date:
- Sheet       of

### Library data of the parts
C37-C42 = CAP: Capacitor; Published: 8-Jun-2000; Revision: July-2002: Re-released for DXP Platform.; Publisher: Altium Limited; Value: 100nF
C43-C46 C49 C50 C93-C95 = CAP: Capacitor; Value: 100nF; Published: 8-Jun-2000; Revision: July-2002: Re-released for DXP Platform.; Publisher: Altium Limited
C47 = Cap Pol1: as C12 on sheet USB_OTG_FS; Published: 8-Jun-2000; Revision: July-2002: Re-released for DXP Platform.; Publisher: Altium Limited
R72-R75 R80-R83 = res1: Resistor; Value: 1K; Published: 8-Jun-2000; Revision: July-2002: Re-released for DXP Platform.; Publisher: Altium Limited
U25 = Speaker: Loudspeaker; Published: 24-Mar-1999; Revision: July-2002: Re-released for DXP Platform.; Publisher: Altium Limited

## Sheet IO Peripherals.SchDoc
size A4; Revision: B.2(PCB.SCH)
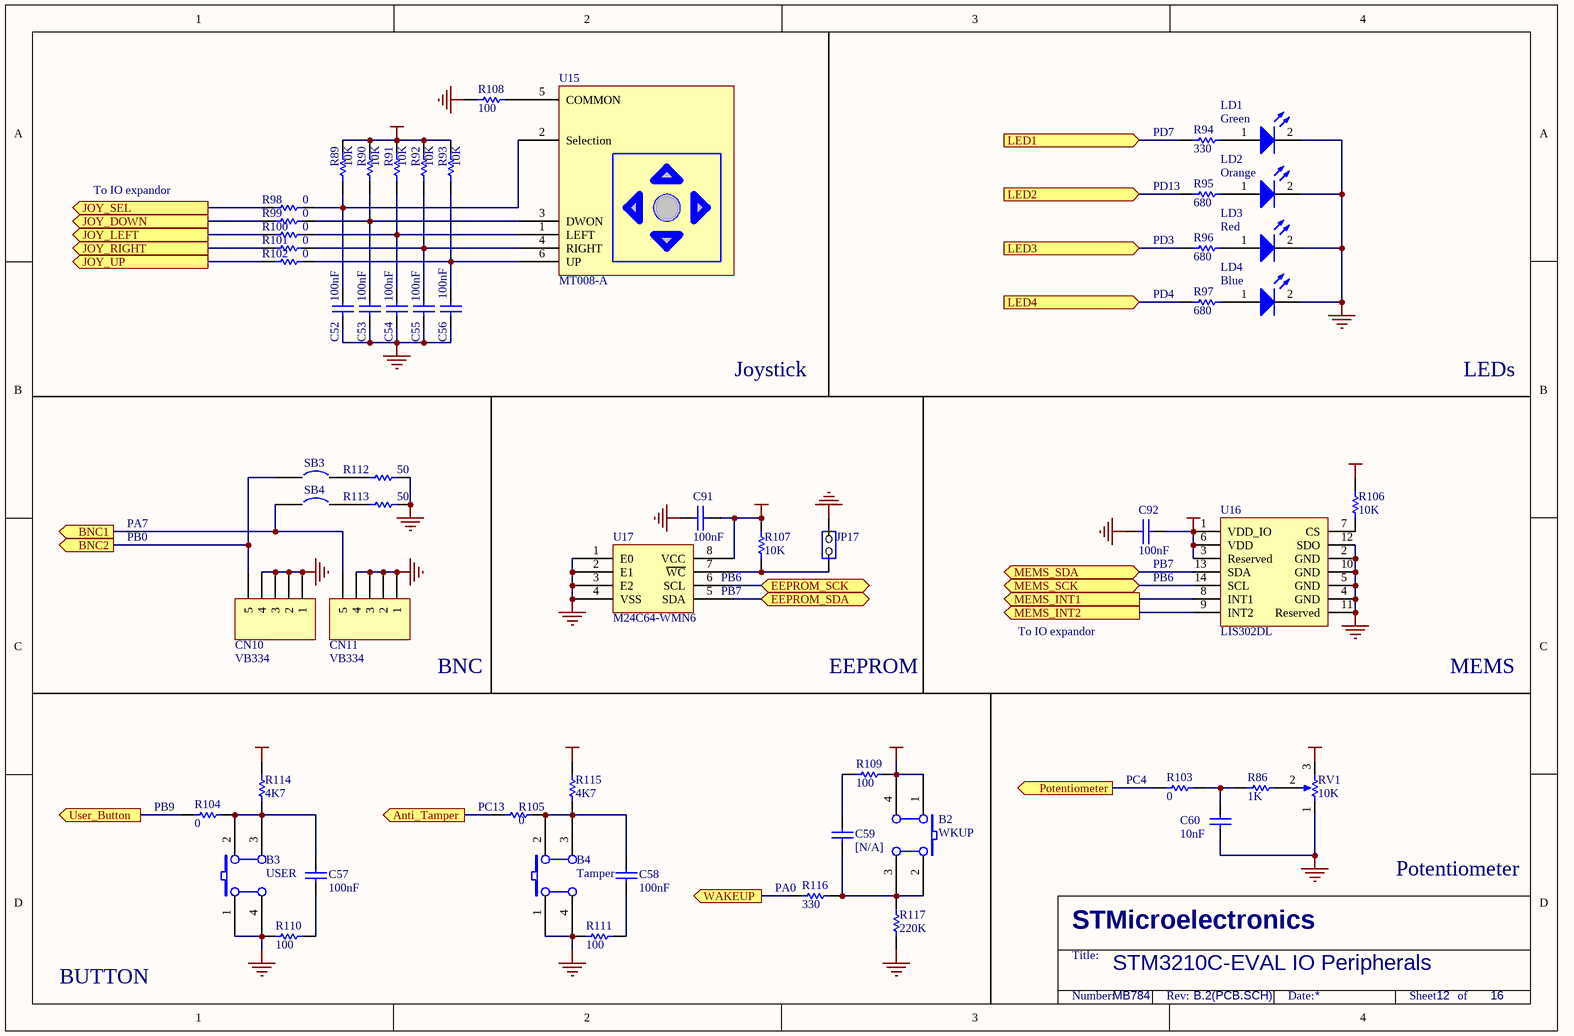
[diagram p5: IO Peripherals.SchDoc]

### Parts
B2  WKUP  [PB10]
B3  USER  [PB10]
B4  Tamper  [PB10]
C52  100nF  [0603C]
C53  100nF  [0603C]
C54  100nF  [0603C]
C55  100nF  [0603C]
C56  100nF  [0603C]
C57  100nF  [0603C]
C58  100nF  [0603C]
C59  [N/A]  [0603C]
C60  10nF  [0603C]
C91  100nF  [0603C]
C92  100nF  [0603C]
CN10  VB334  [VB334]
CN11  VB334  [VB334]
JP17  (no value)  [SIP2]
LD1  Green  [0603D]
LD2  Orange  [0603D]
LD3  Red  [0603D]
LD4  Blue  [0603D]
R86  1K  [0603R]
R89  10K  [0603R]
R90  10K  [0603R]
R91  10K  [0603R]
R92  10K  [0603R]
R93  10K  [0603R]
R94  330  [0603R]
R95  680  [0603R]
R96  680  [0603R]
R97  680  [0603R]
R98  0  [0603R]
R99  0  [0603R]
R100  0  [0603R]
R101  0  [0603R]
R102  0  [0603R]
R103  0  [0603R]
R104  0  [0603R]
R105  0  [0603R]
R106  10K  [0603R]
R107  10K  [0603R]
R108  100  [0603R]
R109  100  [0603R]
R110  100  [0603R]
R111  100  [0603R]
R112  50  [0603R]
R113  50  [0603R]
R114  4K7  [0603R]
R115  4K7  [0603R]
R116  330  [0603R]
R117  220K  [0603R]
RV1  10K  [ADJRH]
SB3  (no value)  [JP2_SMD]
SB4  (no value)  [JP2_SMD]
U15  MT008-A  [JOY]
U16  LIS302DL  [LGA14(3*5)]
U17  M24C64-WMN6  [SO8]

### Ports
Anti_Tamper (out), BNC1 (out), BNC2 (out), EEPROM_SCK (bidir), EEPROM_SDA (bidir), JOY_DOWN (out), JOY_LEFT (out), JOY_RIGHT (out), JOY_SEL (out), JOY_UP (out), LED1 (in), LED2 (in), LED3 (in), LED4 (in), MEMS_INT1 (out), MEMS_INT2 (out), MEMS_SCK (bidir), MEMS_SDA (bidir), Potentiometer (out), User_Button (out), WAKEUP (out)

### Nets
+3V3: B2.1(A0) B2.4(A1) C91.2 C92.2 R89.1 R90.2 R91.2 R92.2 R93.2 R106.1 R107.1 R109.1 R114.2 R115.2 RV1.3(TOP) U16.1(VDD_IO) U16.3(Reserved) U16.6(VDD) U17.8(VCC)
GND: B3.1(A0) B3.4(A1) B4.1(A0) B4.4(A1) C52.1 C53.1 C54.1 C55.1 C56.1 C60.1 C91.1 C92.1 CN10.1 CN10.2 CN10.3 CN10.4 CN11.1 CN11.2 CN11.3 CN11.4 JP17.2(NO) LD1.2(K) LD2.2(K) LD3.2(K) LD4.2(K) R108.1 R110.1 R111.1 R112.2 R113.2 R117.2 RV1.1(BOT) U16.2(GND) U16.4(GND) U16.5(GND) U16.10(GND) U16.11(Reserved) U16.12(SDO) U17.1(E0) U17.2(E1) U17.3(E2) U17.4(VSS)
PB9: R104.2 ; port User_Button
PC4: R103.1 ; port Potentiometer
PD3: R96.2 ; port LED3
PD4: R97.2 ; port LED4
PD7: R94.2 ; port LED1
PD13: R95.2 ; port LED2
NetB2_2: B2.2(B0) B2.3(B1) C59.2 R116.1 R117.1
NetB3_2: B3.2(B0) B3.3(B1) C57.2 R104.1 R114.1
NetB4_2: B4.2(B0) B4.3(B1) C58.2 R105.1 R115.1
NetC52_2: C52.2 R89.2 R98.1 U15.2(Selection)
NetC53_2: C53.2 R90.1 R99.1 U15.3(DWON)
NetC54_2: C54.2 R91.1 R100.1 U15.1(LEFT)
NetC55_2: C55.2 R92.1 R101.1 U15.4(RIGHT)
NetC56_2: C56.2 R93.1 R102.1 U15.6(UP)
NetC57_1: C57.1 R110.2
NetC58_1: C58.1 R111.2
NetC59_1: C59.1 R109.2
NetC60_2: C60.2 R86.1 R103.2
NetCN10_5: CN10.5 SB3.1 ; port BNC2
NetCN11_5: CN11.5 SB4.1 ; port BNC1
NetJP1_3: R105.2 ; port Anti_Tamper
NetJP14_3: R116.2 ; port WAKEUP
NetJP17_1: JP17.1(COMMON) R107.2 U17.7(~{WC})
NetLD1_1: LD1.1(A) R94.1
NetLD2_1: LD2.1(A) R95.1
NetLD3_1: LD3.1(A) R96.1
NetLD4_1: LD4.1(A) R97.1
NetR86_2: R86.2 RV1.2(TAP)
NetR98_2: R98.2 ; port JOY_SEL
NetR99_2: R99.2 ; port JOY_DOWN
NetR100_2: R100.2 ; port JOY_LEFT
NetR101_2: R101.2 ; port JOY_RIGHT
NetR102_2: R102.2 ; port JOY_UP
NetR106_2: R106.2 U16.7(CS)
NetR108_2: R108.2 U15.5(COMMON)
NetR112_1: R112.1 SB3.2
NetR113_1: R113.1 SB4.2
NetU16_8: U16.8(INT1) ; port MEMS_INT1
NetU16_9: U16.9(INT2) ; port MEMS_INT2
NetU16_13: U16.13(SDA) ; port MEMS_SDA
NetU16_14: U16.14(SCL) ; port MEMS_SCK
NetU17_5: U17.5(SDA) ; port EEPROM_SDA
NetU17_6: U17.6(SCL) ; port EEPROM_SCK

### Notes on the sheet
- (near R94) PD7
- To IO expandor
- (near R95) PD13
- (near R96) PD3
- (near R97) PD4
- Joystick
- LEDs
- PA7
- PB0
- PB6
- (near C92) PB7
- PB7
- BNC
- EEPROM
- MEMS
- (near R103) PC4
- (near R104) PB9
- (near R105) PC13
- (near R116) PA0
- Potentiometer
- BUTTON
- STM3210C-EVAL IO Peripherals
- MB784
- 12
- 16
- STMicroelectronics
- Title:
- Number:
- Rev:
- Date:
- Sheet       of

### Library data of the parts
B2-B4 = SW PUSHBUTTON: SE PUSHBUTTON
C52-C60 = CAP: Capacitor; Value: 100pF; Published: 8-Jun-2000; Revision: July-2002: Re-released for DXP Platform.; Publisher: Altium Limited
C91 C92 = CAP: Capacitor
CN10 CN11 = Header 5: Header, 5-Pin; Revision: 17-Jul-2002: Re-released for DXP Platform.; Publisher: Altium Limited
JP17 = JP2
LD1-LD4 = LED2: as LD5 on sheet USB_OTG_FS; Published: 8-Jun-2000; Revision: July-2002: Re-released for DXP Platform.; Publisher: Altium Limited
R86 = Res1: Resistor; Published: 8-Jun-2000; Revision: July-2002: Re-released for DXP Platform.; Publisher: Altium Limited; Value: 1K
R89-R105 R108-R113 R116 = Res1: Resistor; Value: 1K; Published: 8-Jun-2000; Revision: July-2002: Re-released for DXP Platform.; Publisher: Altium Limited
R106 R107 R114 R115 R117 = res1: Resistor; Value: 1K; Published: 8-Jun-2000; Revision: July-2002: Re-released for DXP Platform.; Publisher: Altium Limited
RV1 = RV
SB3 SB4 = Circuit Breaker: Published: 24-Mar-1999; Revision: July-2002: Re-released for DXP Platform.; Publisher: Altium Limited
U15 = MT-008A

## Sheet ExtensionConnector.SchDoc
size A4; Revision: B.2(PCB.SCH)
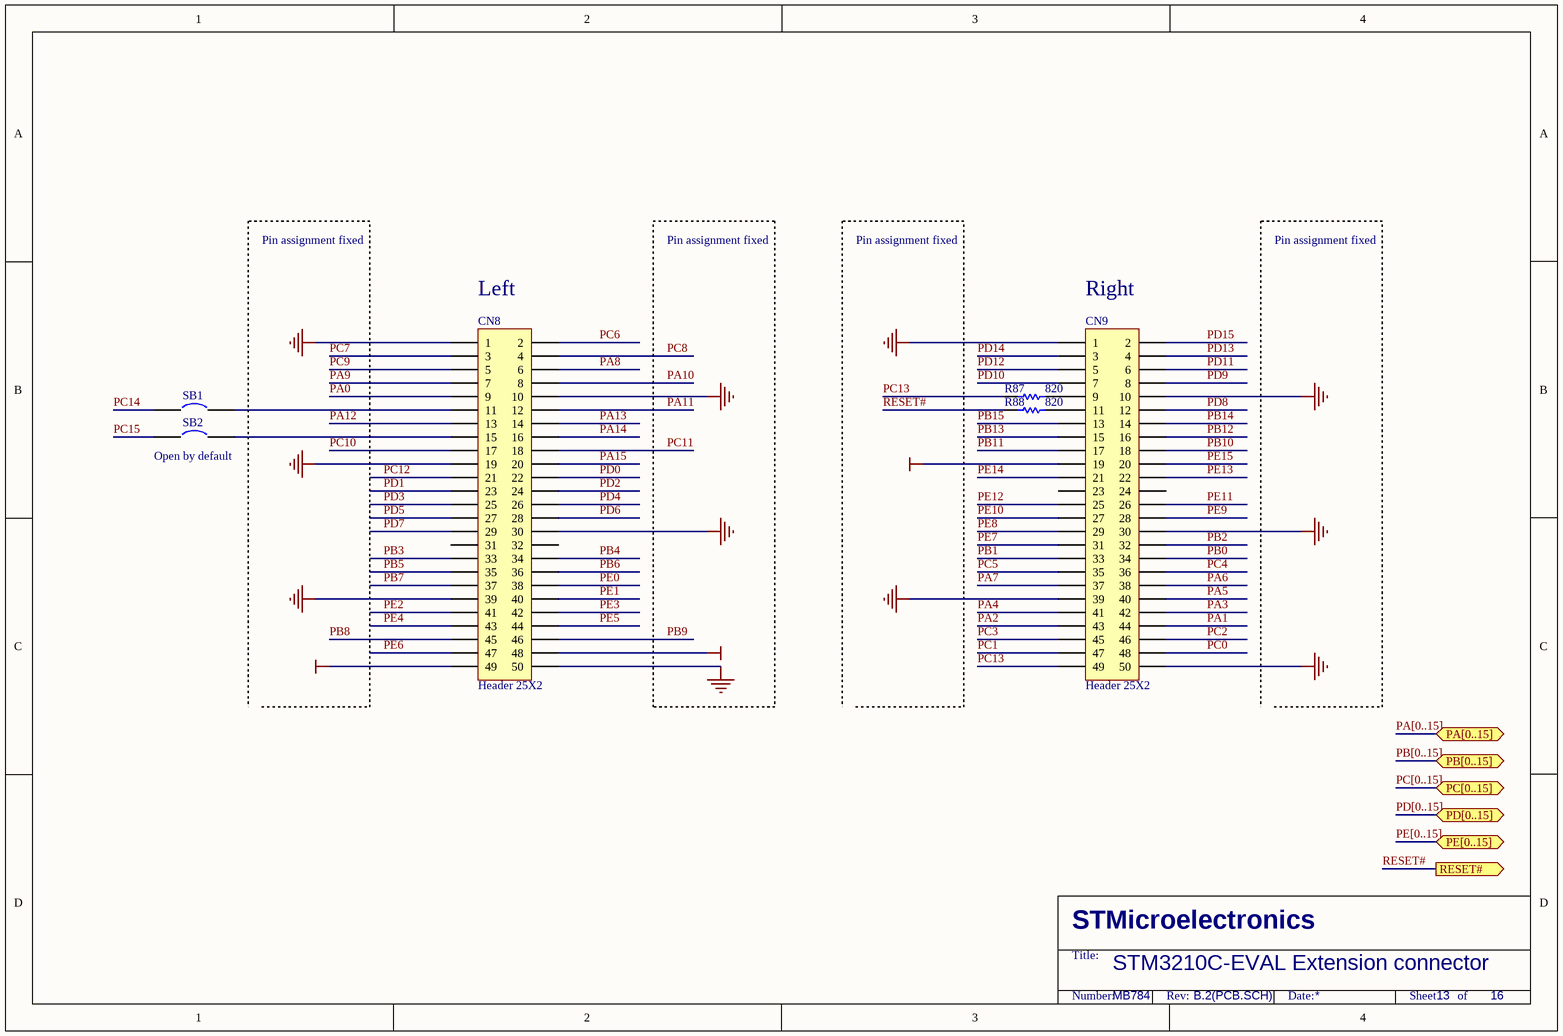
[diagram p6: ExtensionConnector.SchDoc]

### Parts
CN8  Header 25X2  [2*25P]
CN9  Header 25X2  [2*25P]
R87  820  [0603R]
R88  820  [0603R]
SB1  (no value)  [JP2_SMD]
SB2  (no value)  [JP2_SMD]

### Ports
PA[0..15] (bidir), PB[0..15] (bidir), PC[0..15] (bidir), PD[0..15] (bidir), PE[0..15] (bidir), RESET# (out)

### Nets
+3V3: CN8.48
D5V: CN8.49 CN9.19
GND: CN8.1 CN8.10 CN8.19 CN8.30 CN8.39 CN8.50 CN9.1 CN9.10 CN9.30 CN9.39 CN9.50
PA0: CN8.9
PA1: CN9.44
PA2: CN9.43
PA3: CN9.42
PA4: CN9.41
PA5: CN9.40
PA6: CN9.38
PA7: CN9.37
PA8: CN8.6
PA9: CN8.7
PA10: CN8.8
PA11: CN8.12
PA12: CN8.13
PA13: CN8.14
PA14: CN8.16
PA15: CN8.20
PB0: CN9.34
PB1: CN9.33
PB2: CN9.32
PB3: CN8.33
PB4: CN8.34
PB5: CN8.35
PB6: CN8.36
PB7: CN8.37
PB8: CN8.45
PB9: CN8.46
PB10: CN9.18
PB11: CN9.17
PB12: CN9.16
PB13: CN9.15
PB14: CN9.14
PB15: CN9.13
PC0: CN9.48
PC1: CN9.47
PC2: CN9.46
PC3: CN9.45
PC4: CN9.36
PC5: CN9.35
PC6: CN8.2
PC7: CN8.3
PC8: CN8.4
PC9: CN8.5
PC10: CN8.17
PC11: CN8.18
PC12: CN8.21
PC13: CN9.49 R87.1
PC14: SB1.1
PC15: SB2.1
PD0: CN8.22
PD1: CN8.23
PD2: CN8.24
PD3: CN8.25
PD4: CN8.26
PD5: CN8.27
PD6: CN8.28
PD7: CN8.29
PD8: CN9.12
PD9: CN9.8
PD10: CN9.7
PD11: CN9.6
PD12: CN9.5
PD13: CN9.4
PD14: CN9.3
PD15: CN9.2
PE0: CN8.38
PE1: CN8.40
PE2: CN8.41
PE3: CN8.42
PE4: CN8.43
PE5: CN8.44
PE6: CN8.47
PE7: CN9.31
PE8: CN9.29
PE9: CN9.28
PE10: CN9.27
PE11: CN9.26
PE12: CN9.25
PE13: CN9.22
PE14: CN9.21
PE15: CN9.20
RESET#: R88.2 ; port RESET#
NetCN8_11: CN8.11 SB1.2
NetCN8_15: CN8.15 SB2.2
NetCN9_9: CN9.9 R87.2
NetCN9_11: CN9.11 R88.1

Not connected (* = marked no-connect by the designer): CN8 31 32; CN9 23 24

### Buses and harness runs
bus PA[0..15] = port PA[0..15]
bus PB[0..15] = port PB[0..15]
bus PC[0..15] = port PC[0..15]
bus PD[0..15] = port PD[0..15]
bus PE[0..15] = port PE[0..15]

### Notes on the sheet
- Pin assignment fixed
- (near CN8) Left
- (near CN9) Right
- (near SB2) Open by default
- STM3210C-EVAL Extension connector
- MB784
- 13
- 16
- STMicroelectronics
- Title:
- Number:
- Rev:
- Date:
- Sheet       of

### Library data of the parts
CN8 CN9 = Header 25X2: Header, 25-Pin, Dual row; Revision: 17-Jul-2002: Re-released for DXP Platform.; Publisher: Altium Limited
R87 R88 = Res1: Resistor; Value: 1K; Published: 8-Jun-2000; Revision: July-2002: Re-released for DXP Platform.; Publisher: Altium Limited
SB1 SB2 = Circuit Breaker: Published: 24-Mar-1999; Revision: July-2002: Re-released for DXP Platform.; Publisher: Altium Limited

## Sheet JTAG&Trace.SchDoc
size A4; Revision: B.2(PCB.SCH)
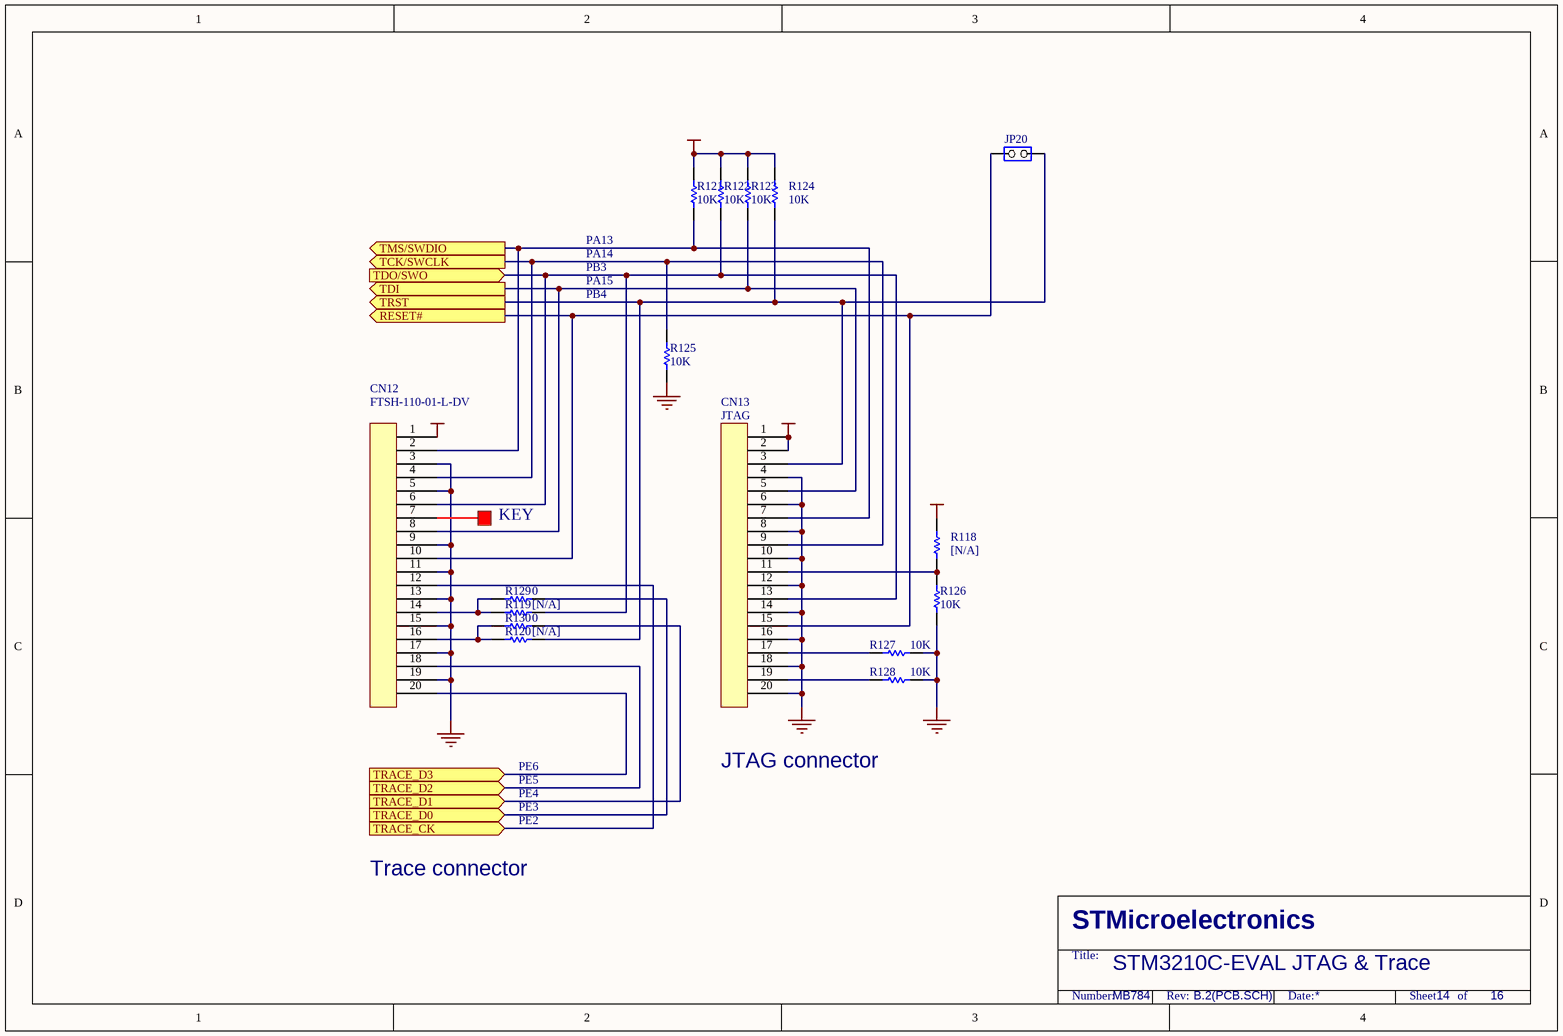
[diagram p7: JTAG&Trace.SchDoc]

### Parts
CN12  FTSH-110-01-L-DV  [FTSH-110-01-L-DV]
CN13  JTAG  [IDC20S]
JP20  (no value)  [SIP2]
R118  [N/A]  [0603R]
R119  [N/A]  [0603R]
R120  [N/A]  [0603R]
R121  10K  [0603R]
R122  10K  [0603R]
R123  10K  [0603R]
R124  10K  [0603R]
R125  10K  [0603R]
R126  10K  [0603R]
R127  10K  [0603R]
R128  10K  [0603R]
R129  0  [0603R]
R130  0  [0603R]

### Ports
RESET# (out), TCK/SWCLK (out), TDI (out), TDO/SWO (in), TMS/SWDIO (out), TRACE_CK (in), TRACE_D0 (in), TRACE_D1 (in), TRACE_D2 (in), TRACE_D3 (in), TRST (out)

### Nets
+3V3: CN12.1 CN13.1 CN13.2 R118.2 R121.2 R122.2 R123.2 R124.2
GND: CN12.3 CN12.5 CN12.9 CN12.11 CN12.13 CN12.15 CN12.17 CN12.19 CN13.4 CN13.6 CN13.8 CN13.10 CN13.12 CN13.14 CN13.16 CN13.18 CN13.20 R125.1 R126.1 R127.2 R128.2
PA13: CN12.2 CN13.7 R121.1 ; port TMS/SWDIO
PA14: CN12.4 CN13.9 R125.2 ; port TCK/SWCLK
PA15: CN12.8 CN13.5 R123.1 ; port TDI
PB3: CN12.6 CN13.13 R119.2 R122.1 ; port TDO/SWO
PB4: CN13.3 JP20.1(COMMON) R120.2 R124.1 ; port TRST
PE2: CN12.12 ; port TRACE_CK
PE3: R129.2 ; port TRACE_D0
PE4: R130.2 ; port TRACE_D1
PE5: CN12.18 ; port TRACE_D2
PE6: CN12.20 ; port TRACE_D3
RESET#: CN12.10 CN13.15 JP20.2(NO) ; port RESET#
NetCN12_14: CN12.14 R119.1 R129.1
NetCN12_16: CN12.16 R120.1 R130.1
NetCN13_11: CN13.11 R118.1 R126.2
NetCN13_17: CN13.17 R127.1
NetCN13_19: CN13.19 R128.1

Not connected (* = marked no-connect by the designer): CN12 7

### Notes on the sheet
- PA13
- PA14
- PB3
- PA15
- PB4
- KEY
- PE6
- PE5
- JTAG connector
- PE4
- PE3
- PE2
- Trace connector
- STM3210C-EVAL JTAG & Trace
- MB784
- 14
- 16
- STMicroelectronics
- Title:
- Number:
- Rev:
- Date:
- Sheet       of

### Library data of the parts
CN12 CN13 = 20PIN1
JP20 = JP2
R118-R130 = Res1: Resistor; Value: 1K; Published: 8-Jun-2000; Revision: July-2002: Re-released for DXP Platform.; Publisher: Altium Limited

## Sheet Power.SchDoc
size A4; Revision: B.2(PCB.SCH)
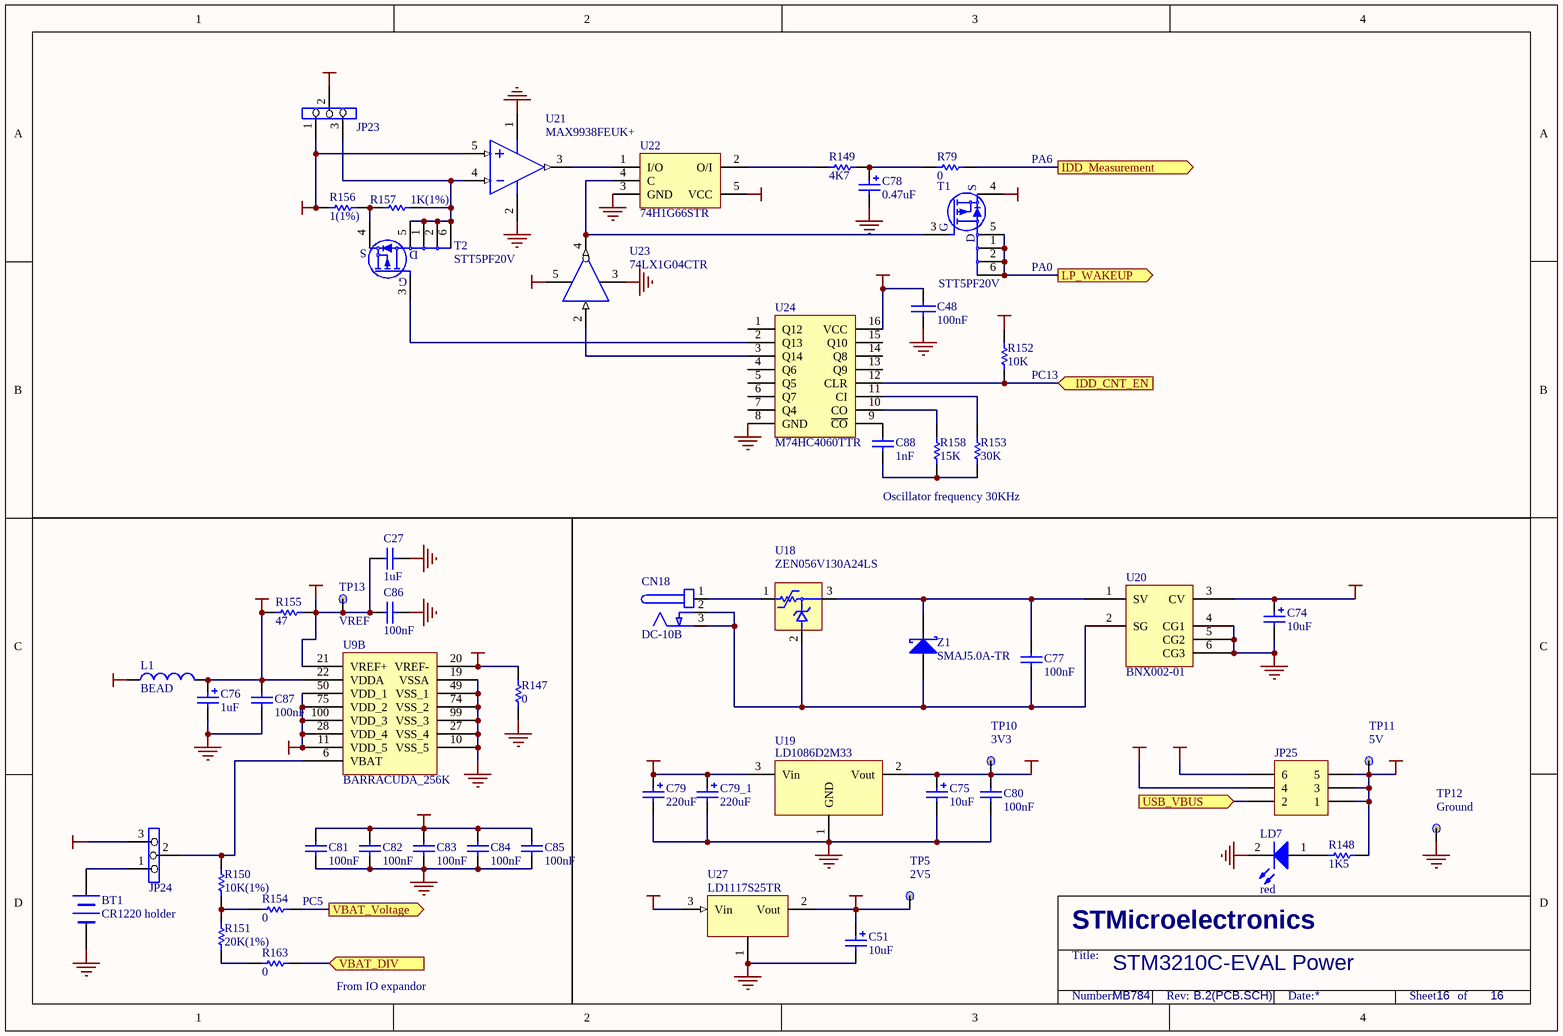
[diagram p8: Power.SchDoc]

### Parts
BT1  CR1220 holder  [LI1220_1]
C27  1uF  [0603C]
C48  100nF  [0603C]
C51  10uF  [TAN-A]
C74  10uF  [C160M]
C75  10uF  [TAN-A]
C76  1uF  [TAN-A]
C77  100nF  [0603C]
C78  0.47uF  [0603C]
C79  220uF  [C310M]
C79_1  220uF  [C310M]
C80  100nF  [0603C]
C81  100nF  [0603C]
C82  100nF  [0603C]
C83  100nF  [0603C]
C84  100nF  [0603C]
C85  100nF  [0603C]
C86  100nF  [0603C]
C87  100nF  [0603C]
C88  1nF  [0603C]
CN18  DC-10B  [DC10B]
JP23  (no value)  [SIP3]
JP24  (no value)  [SIP3]
JP25  (no value)  [2*3P]
L1  BEAD  [0603L]
LD7  red  [0603D]
R79  0  [0603R]
R147  0  [0603R]
R148  1K5  [0603R]
R149  4K7  [0603R]
R150  10K(1%)  [0603R]
R151  20K(1%)  [0603R]
R152  10K  [0603R]
R153  30K  [0603R]
R154  0  [0603R]
R155  47  [0603R]
R156  1(1%)  [0603R]
R157  1K(1%)  [0603R]
R158  15K  [0603R]
R163  0  [0603R]
T1  STT5PF20V  [SOT-23-6L]
T2  STT5PF20V  [SOT-23-6L]
TP5  2V5  [TP]
TP10  3V3  [TP]
TP11  5V  [TP]
TP12  Ground  [TP]
TP13  VREF  [TP]
U9  BARRACUDA_256K  [TQ100_TOOL]  (part B of 2)
U18  ZEN056V130A24LS  [polyzen]
U19  LD1086D2M33  [D2PAK/A]
U20  BNX002-01  [BNX001]
U21  MAX9938FEUK+  [SOT-23-5L]
U22  74H1G66STR  [SOT-23-5L]
U23  74LX1G04CTR  [SOT323-5L]
U24  M74HC4060TTR  [TSSOP16]
U27  LD1117S25TR  [SOT-223]
Z1  SMAJ5.0A-TR  [1R1C]

### Ports
IDD_CNT_EN (in), IDD_Measurement (out), LP_WAKEUP (out), USB_VBUS (in), VBAT_DIV (in), VBAT_Voltage (out)

### Nets
+2V5: C51.1 TP5.1 U27.2(Vout)
+3V3: C48.1 C75.1 C80.1 JP23.1 JP24.3 R152.1 R156.2 T1.4(S) TP10.1 U19.2(Vout) U21.5(Vp) U22.5(VCC) U23.5(VCC) U24.16(VCC)
+5V: C79.1 C79_1.1 JP25.1 JP25.3 JP25.5 R148.2 TP11.1 U19.3(Vin) U27.3(Vin)
D5V: JP25.4
E5V: C74.1 JP25.6 U20.3(CV)
GND: BT1.2(-) C27.2 C48.2 C51.2 C74.2 C75.2 C76.2 C78.2 C79.2 C79_1.2 C80.2 C81.2 C82.2 C83.2 C84.2 C85.2 C86.2 C87.2 LD7.2(K) R147.1 TP12.1 U9.10(VSS_5) U9.19(VSSA) U9.27(VSS_4) U9.49(VSS_1) U9.74(VSS_2) U9.99(VSS_3) U19.1(GND) U20.4(CG1) U20.5(CG2) U20.6(CG3) U21.1(GND) U21.2(GND) U22.3(GND) U23.3(GND) U24.8(GND) U27.1
VDD_MCU: C81.1 C82.1 C83.1 C84.1 C85.1 JP23.2 L1.1 U9.11(VDD_5) U9.28(VDD_4) U9.50(VDD_1) U9.75(VDD_2) U9.100(VDD_3)
VDDA: C76.1 C87.1 L1.2 R155.2 U9.22(VDDA)
VREF+: C27.1 C86.1 R155.1 TP13.1 U9.21(VREF+)
VREF-: R147.2 U9.20(VREF-)
PA6: R79.2 ; port IDD_Measurement
NetBT1_1: BT1.1(+) JP24.1
NetC12_1: JP25.2 ; port USB_VBUS
NetC77_1: C77.1 U18.3 U20.1(SV) Z1.2(K)
NetC77_2: C77.2 CN18.2(GND) CN18.3(GND) U18.2 U20.2(SG) Z1.1(A)
NetC78_1: C78.1 R79.1 R149.2
NetC88_1: C88.1 U24.9(~{CO})
NetC88_2: C88.2 R153.2 R158.2
NetCN18_1: CN18.1(+) U18.1
NetJP1_1: R152.2 U24.12(CLR) ; port IDD_CNT_EN
NetJP23_3: JP23.3 R157.1 T2.1(D) T2.2(D) T2.5(D) T2.6(D) U21.4(Vm)
NetJP24_2: JP24.2 R150.2 U9.6(VBAT)
NetLD7_1: LD7.1(A) R148.1
NetR149_1: R149.1 U22.2(O/I)
NetR150_1: R150.1 R151.2 R154.2
NetR151_1: R151.1 R163.2
NetR153_1: R153.1 U24.11(CI)
NetR154_1: R154.1 ; port VBAT_Voltage
NetR156_1: R156.1 R157.2 T2.4(S)
NetR158_1: R158.1 U24.10(CO)
NetR163_1: R163.1 ; port VBAT_DIV
NetT1_1: T1.1(D) T1.2(D) T1.5(D) T1.6(D) ; port LP_WAKEUP
NetT1_3: T1.3(G) U22.4(C) U23.4(1Y)
NetT2_3: T2.3(G) U24.2(Q13)
NetU21_3: U21.3(OUT) U22.1(I/O)
NetU23_2: U23.2(1A) U24.3(Q14)

Not connected (* = marked no-connect by the designer): U23 1(NC); U24 1(Q12) 4(Q6) 5(Q5) 6(Q7) 7(Q4) 13(Q9) 14(Q8) 15(Q10)

### Notes on the sheet
- PA6
- PA0
- (near R152) PC13
- Oscillator frequency 30KHz
- (near R154) PC5
- (near R163) From IO expandor
- STM3210C-EVAL Power
- MB784
- 16
- STMicroelectronics
- Title:
- Number:
- Rev:
- Date:
- Sheet       of

### Library data of the parts
BT1 = BATTERY
C27 C80-C88 = Cap: Capacitor; Value: 10nF; Published: 8-Jun-2000; Revision: July-2002: Re-released for DXP Platform.; Publisher: Altium Limited
C48 = CAP
C51 C75 = Cap Pol1: Polarized Capacitor (Radial); Published: 8-Jun-2000; Revision: July-2002: Re-released for DXP Platform.; Publisher: Altium Limited; Value: 10uF
C74 = Cap Pol1: as C12 on sheet USB_OTG_FS; Published: 8-Jun-2000; Revision: July-2002: Re-released for DXP Platform.; Publisher: Altium Limited
C76 C78 C79 C79_1 = Cap Pol1: Polarized Capacitor (Radial); Value: 10uF; Published: 8-Jun-2000; Revision: July-2002: Re-released for DXP Platform.; Publisher: Altium Limited
C77 = CAP: Capacitor; Value: 100pF; Published: 8-Jun-2000; Revision: July-2002: Re-released for DXP Platform.; Publisher: Altium Limited
CN18 = PJ202A
JP23 JP24 = Jumper3
JP25 = Header 3X2: Header, 3-Pin, Dual row; Revision: 17-Jul-2002: Re-released for DXP Platform.; Publisher: Altium Limited
L1 = Inductor: Value: 100uH; Published: 8-Jun-2000; Revision: July-2002: Re-released for DXP Platform.; Publisher: Altium Limited
LD7 = LED2: as LD5 on sheet USB_OTG_FS; Published: 8-Jun-2000; Revision: July-2002: Re-released for DXP Platform.; Publisher: Altium Limited
R79 R148-R154 R156 R158 R163 = res1: Resistor; Value: 1K; Published: 8-Jun-2000; Revision: July-2002: Re-released for DXP Platform.; Publisher: Altium Limited
R147 R155 = Res1: Resistor; Value: 1K; Published: 8-Jun-2000; Revision: July-2002: Re-released for DXP Platform.; Publisher: Altium Limited
R157 = res1: Resistor; Published: 8-Jun-2000; Revision: July-2002: Re-released for DXP Platform.; Publisher: Altium Limited; Value: 1K
TP5 TP10-TP13 = TP
U19 = VOLTREG1
U20 = BNX002
U21 = TSC101BILT
U27 = LD1117
Z1 = D Schottky: Schottky Diode; Code - JEDEC: DO-214-AA; Published: 8-Jun-2000; Revision: July-2002: Re-released for DXP Platform.; Publisher: Altium Limited

## Sheet MicroSDCard.SchDoc
size A4; Revision: B.2(PCB.SCH)
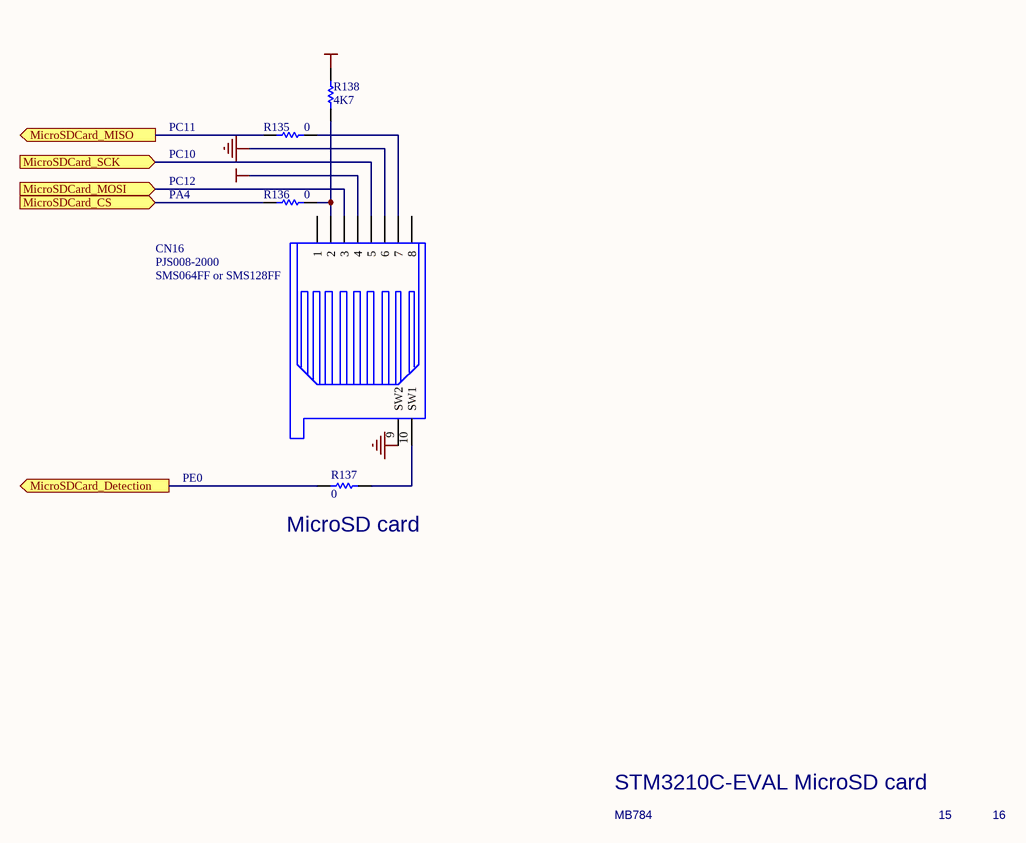
[diagram p9: MicroSDCard.SchDoc]

### Parts
CN16  PJS008-2000  [MSD(PJS008)]
R135  0  [0603R]
R136  0  [0603R]
R137  0  [0603R]
R138  4K7  [0603R]

### Ports
MicroSDCard_CS (in), MicroSDCard_Detection (out), MicroSDCard_MISO (out), MicroSDCard_MOSI (in), MicroSDCard_SCK (in)

### Nets
+3V3: CN16.4 R138.2
GND: CN16.6 CN16.9(SW2)
NetCN16_2: CN16.2 R136.1 R138.1
NetCN16_3: CN16.3 ; port MicroSDCard_MOSI
NetCN16_5: CN16.5 ; port MicroSDCard_SCK
NetCN16_7: CN16.7 R135.2
NetCN16_10: CN16.10(SW1) R137.2
NetJP15_2: R136.2 ; port MicroSDCard_CS
NetJP26_1: R137.1 ; port MicroSDCard_Detection
NetR135_1: R135.1 ; port MicroSDCard_MISO

Not connected (* = marked no-connect by the designer): CN16 1 8

### Notes on the sheet
- PC11
- PC10
- PC12
- PA4
- (near CN16) SMS064FF or SMS128FF
- PE0
- (near R137) MicroSD card
- STM3210C-EVAL MicroSD card
- MB784
- 15
- 16
- STMicroelectronics
- Title:
- Number:
- Rev:
- Date:
- Sheet       of

### Library data of the parts
CN16 = SMS016AFA5E
R135-R138 = Res1: Resistor; Value: 1K; Published: 8-Jun-2000; Revision: July-2002: Re-released for DXP Platform.; Publisher: Altium Limited

## Nets that join several sheets
+2V5: Audio (8 pins), Power (C51.1 TP5.1 U27.2)
+3V3: USB_OTG_FS (R33.2 R34.1 R39.2 R40.1), Ethernet (27 pins), IO_Expandor (10 pins), MCU (R62.2 SW1.1 SW2.1), Audio (C42.2 U13.33), IO Peripherals (19 pins), ExtensionConnector (CN8.48), JTAG&Trace (8 pins), Power (14 pins), MicroSDCard (CN16.4 R138.2)
+5V: USB_OTG_FS (U3.5), Audio (C37.1 C38.1 U13.5 U13.8), Power (9 pins)
D5V: ExtensionConnector (CN8.49 CN9.19), Power (JP25.4)
GND: USB_OTG_FS (7 pins), Ethernet (21 pins), IO_Expandor (7 pins), MCU (9 pins), Audio (22 pins), IO Peripherals (42 pins), ExtensionConnector (11 pins), JTAG&Trace (21 pins), Power (37 pins), MicroSDCard (CN16.6 CN16.9)
NetC12_1: USB_OTG_FS (5 pins), MCU (R78.1), Power (JP25.2)
NetJP1_1: MCU (JP1.1), Power (R152.2 U24.12)
NetJP1_3: MCU (JP1.3), IO Peripherals (R105.2)
NetJP2_1: Ethernet (JP2.1 RS4.6), MCU (JP13.3)
NetJP10_1: MCU (JP10.1), Audio (U13.37)
NetJP11_3: Ethernet (RS4.2), MCU (JP11.3)
NetJP12_3: Ethernet (RS4.4), MCU (JP12.3)
NetJP14_1: Ethernet (RS2.8), MCU (JP14.1)
NetJP14_3: MCU (JP14.3), IO Peripherals (R116.2)
NetJP15_2: MCU (JP15.2), MicroSDCard (R136.2)
NetJP26_1: MCU (JP26.1), MicroSDCard (R137.1)
PA0: MCU (JP14.2 U9.23), ExtensionConnector (CN8.9)
PA1: Ethernet (JP3.2), MCU (U9.24), ExtensionConnector (CN9.44)
PA2: Ethernet (R162.1), MCU (U9.25), ExtensionConnector (CN9.43)
PA3: Ethernet (RS2.4), MCU (U9.26), ExtensionConnector (CN9.42)
PA4: MCU (JP15.1 U9.29), Audio (R83.2), ExtensionConnector (CN9.41)
PA5: MCU (U9.30), ExtensionConnector (CN9.40)
PA6: MCU (U9.31), ExtensionConnector (CN9.38), Power (R79.2)
PA7: MCU (U9.32), ExtensionConnector (CN9.37)
PA8: Ethernet (JP4.3), MCU (TP6.1 U9.67), ExtensionConnector (CN8.6)
PA9: MCU (R78.2 U9.68), ExtensionConnector (CN8.7)
PA10: USB_OTG_FS (R38.2), MCU (U9.69), ExtensionConnector (CN8.8)
PA11: USB_OTG_FS (R42.2 U4.D3), MCU (U9.70), ExtensionConnector (CN8.12)
PA12: USB_OTG_FS (R43.2 U4.C3), MCU (U9.71), ExtensionConnector (CN8.13)
PA13: MCU (U9.72), ExtensionConnector (CN8.14), JTAG&Trace (CN12.2 CN13.7 R121.1)
PA14: MCU (U9.76), ExtensionConnector (CN8.16), JTAG&Trace (CN12.4 CN13.9 R125.2)
PA15: MCU (U9.77), ExtensionConnector (CN8.20), JTAG&Trace (CN12.8 CN13.5 R123.1)
PB0: MCU (U9.35), ExtensionConnector (CN9.34)
PB1: MCU (U9.36), ExtensionConnector (CN9.33)
PB2: MCU (R60.1 U9.37), ExtensionConnector (CN9.32)
PB3: MCU (U9.89), ExtensionConnector (CN8.33), JTAG&Trace (CN12.6 CN13.13 R119.2 R122.1)
PB4: MCU (U9.90), ExtensionConnector (CN8.34), JTAG&Trace (CN13.3 JP20.1 R120.2 R124.1)
PB5: MCU (TP4.1 U9.91), ExtensionConnector (CN8.35)
PB6: MCU (JP9.1 U9.92), ExtensionConnector (CN8.36)
PB7: MCU (U9.93), ExtensionConnector (CN8.37)
PB8: Ethernet (RS1.6), MCU (U9.95), ExtensionConnector (CN8.45)
PB9: MCU (U9.96), IO Peripherals (R104.2), ExtensionConnector (CN8.46)
PB10: Ethernet (RS2.6), MCU (U9.47), ExtensionConnector (CN9.18)
PB11: Ethernet (RS3.6), MCU (U9.48), ExtensionConnector (CN9.17)
PB12: Ethernet (RS3.4), MCU (U9.51), Audio (U13.40), ExtensionConnector (CN9.16)
PB13: Ethernet (RS3.2), MCU (U9.52), Audio (U13.38), ExtensionConnector (CN9.15)
PB14: IO_Expandor (R159.1), MCU (U9.53), ExtensionConnector (CN9.14)
PB15: MCU (U9.54), Audio (U13.39), ExtensionConnector (CN9.13)
PC0: MCU (R165.1 U9.15), ExtensionConnector (CN9.48)
PC1: Ethernet (U1.31), MCU (U9.16), ExtensionConnector (CN9.47)
PC2: Ethernet (RS1.4), MCU (U9.17), ExtensionConnector (CN9.46)
PC3: Ethernet (RS1.2), MCU (U9.18), ExtensionConnector (CN9.45)
PC4: MCU (U9.33), IO Peripherals (R103.1), ExtensionConnector (CN9.36)
PC5: MCU (U9.34), ExtensionConnector (CN9.35)
PC6: MCU (JP10.2 U9.63), ExtensionConnector (CN8.2)
PC7: MCU (U9.64), ExtensionConnector (CN8.3)
PC8: MCU (U9.65), ExtensionConnector (CN8.4)
PC9: USB_OTG_FS (R36.2), MCU (U9.66), ExtensionConnector (CN8.5)
PC10: MCU (U9.78), ExtensionConnector (CN8.17)
PC11: MCU (U9.79), ExtensionConnector (CN8.18)
PC12: MCU (U9.80), ExtensionConnector (CN8.21)
PC13: MCU (JP1.2 U9.7), ExtensionConnector (CN9.49 R87.1)
PC14: MCU (R161.2 U9.8), ExtensionConnector (SB1.1)
PC15: MCU (R59.2 U9.9), ExtensionConnector (SB2.1)
PD0: MCU (U9.81), ExtensionConnector (CN8.22)
PD1: MCU (U9.82), ExtensionConnector (CN8.23)
PD2: MCU (U9.83), ExtensionConnector (CN8.24)
PD3: MCU (U9.84), IO Peripherals (R96.2), ExtensionConnector (CN8.25)
PD4: MCU (U9.85), IO Peripherals (R97.2), ExtensionConnector (CN8.26)
PD5: MCU (U9.86), ExtensionConnector (CN8.27)
PD6: MCU (U9.87), ExtensionConnector (CN8.28)
PD7: MCU (U9.88), IO Peripherals (R94.2), ExtensionConnector (CN8.29)
PD8: MCU (JP13.2 U9.55), ExtensionConnector (CN9.12)
PD9: MCU (JP12.2 U9.56), ExtensionConnector (CN9.8)
PD10: MCU (JP11.2 U9.57), ExtensionConnector (CN9.7)
PD11: Ethernet (RS1.8), MCU (U9.58), ExtensionConnector (CN9.6)
PD12: Ethernet (RS2.2), MCU (U9.59), ExtensionConnector (CN9.5)
PD13: MCU (U9.60), IO Peripherals (R95.2), ExtensionConnector (CN9.4)
PD14: MCU (U9.61), ExtensionConnector (CN9.3)
PD15: MCU (U9.62), ExtensionConnector (CN9.2)
PE0: MCU (JP26.2 U9.97), ExtensionConnector (CN8.38)
PE1: USB_OTG_FS (R35.1), MCU (U9.98), ExtensionConnector (CN8.40)
PE2: MCU (U9.1), ExtensionConnector (CN8.41), JTAG&Trace (CN12.12)
PE3: MCU (U9.2), ExtensionConnector (CN8.42), JTAG&Trace (R129.2)
PE4: MCU (U9.3), ExtensionConnector (CN8.43), JTAG&Trace (R130.2)
PE5: MCU (U9.4), ExtensionConnector (CN8.44), JTAG&Trace (CN12.18)
PE6: MCU (U9.5), ExtensionConnector (CN8.47), JTAG&Trace (CN12.20)
PE7: MCU (U9.38), ExtensionConnector (CN9.31)
PE8: MCU (U9.39), ExtensionConnector (CN9.29)
PE9: MCU (U9.40), ExtensionConnector (CN9.28)
PE10: MCU (U9.41), ExtensionConnector (CN9.27)
PE11: MCU (U9.42), ExtensionConnector (CN9.26)
PE12: MCU (U9.43), ExtensionConnector (CN9.25)
PE13: MCU (U9.44), ExtensionConnector (CN9.22)
PE14: MCU (U9.45), ExtensionConnector (CN9.21)
PE15: MCU (U9.46), ExtensionConnector (CN9.20)
RESET#: MCU (6 pins), ExtensionConnector (R88.2), JTAG&Trace (CN12.10 CN13.15 JP20.2)